# Altium project Mini-Rambo_0.3a.PrjPcb (part 1 of 2)
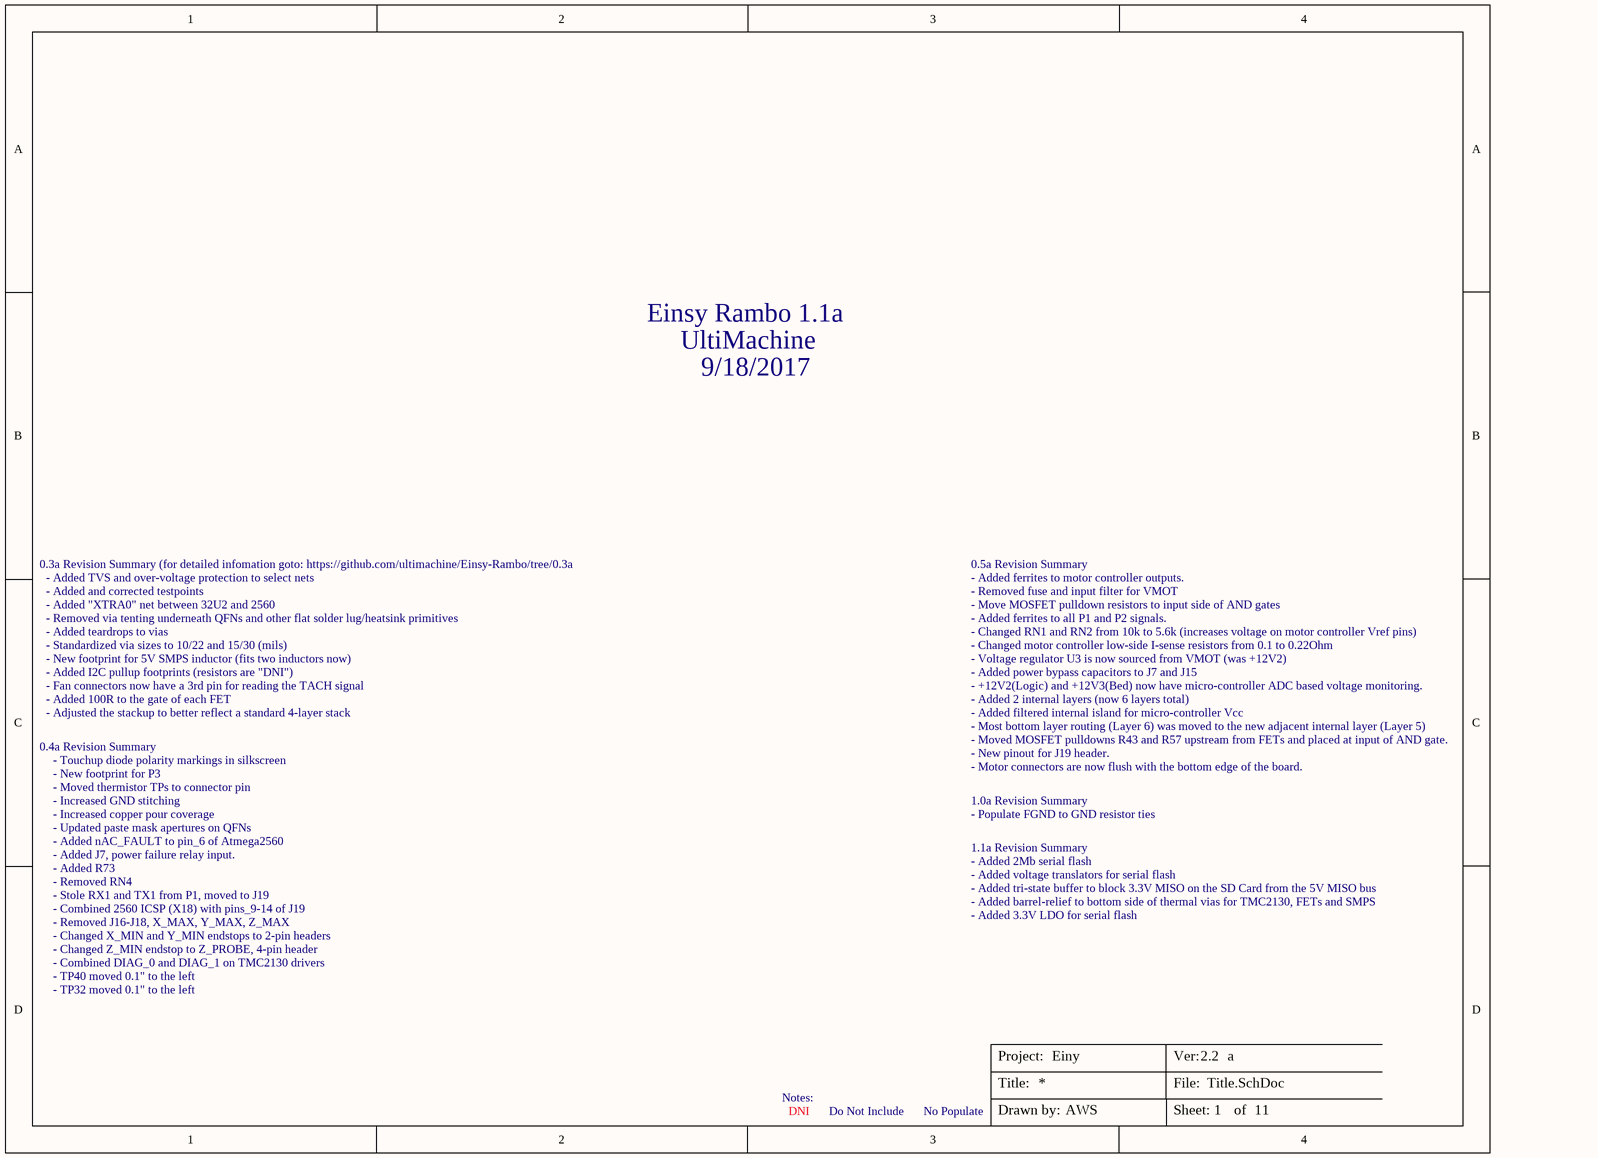
[diagram p0: Title.SchDoc]
projectBoardRevision: a; projectBoardVersion: 2.2; ProjectDesigner: AWS; ProjectTitle: Einy
11 sheets, 417 parts. Net scope: flat (ports and power ports of the same name join across sheets).
Board file: Mini-Rambo.PcbDoc
Sheets:
  Title.SchDoc
  Power-SMPS.SchDoc
  MCU.SchDoc
  USB-Serial.SchDoc
  Connectors.SchDoc
  Endstops.SchDoc
  Heaters.SchDoc
  Motor-X.SchDoc
  Motor-Y.SchDoc
  Motor-Z.SchDoc
  Motor-E.SchDoc

## Sheet Title.SchDoc
size Letter; SheetNumber: 1; SheetTotal: 11

### Notes on the sheet
- Einsy Rambo 1.1a
- UltiMachine
- 9/18/2017
- 0.3a Revision Summary (for detailed infomation goto: https://github.com/ultimachine/Einsy-Rambo/tree/0.3a
- 0.5a Revision Summary
- - Added TVS and over-voltage protection to select nets
- - Added and corrected testpoints
- - Added "XTRA0" net between 32U2 and 2560
- - Removed via tenting underneath QFNs and other flat solder lug/heatsink primitives
- - Added teardrops to vias
- - Added ferrites to motor controller outputs.
- - Removed fuse and input filter for VMOT
- - Move MOSFET pulldown resistors to input side of AND gates
- - Added ferrites to all P1 and P2 signals.
- - Changed RN1 and RN2 from 10k to 5.6k (increases voltage on motor controller Vref pins)
- - Standardized via sizes to 10/22 and 15/30 (mils)
- - New footprint for 5V SMPS inductor (fits two inductors now)
- - Added I2C pullup footprints (resistors are "DNI")
- - Fan connectors now have a 3rd pin for reading the TACH signal
- - Added 100R to the gate of each FET
- - Changed motor controller low-side I-sense resistors from 0.1 to 0.22Ohm
- - Voltage regulator U3 is now sourced from VMOT (was +12V2)
- - Added power bypass capacitors to J7 and J15
- - +12V2(Logic) and +12V3(Bed) now have micro-controller ADC based voltage monitoring.
- - Added 2 internal layers (now 6 layers total)
- 0.4a Revision Summary
- - Adjusted the stackup to better reflect a standard 4-layer stack
- - New footprint for P3
- - Touchup diode polarity markings in silkscreen
- - Added filtered internal island for micro-controller Vcc
- - Most bottom layer routing (Layer 6) was moved to the new adjacent internal layer (Layer 5)
- - Moved MOSFET pulldowns R43 and R57 upstream from FETs and placed at input of AND gate.
- - New pinout for J19 header.
- - Motor connectors are now flush with the bottom edge of the board.
- - Updated paste mask apertures on QFNs
- - Increased copper pour coverage
- - Increased GND stitching
- - Moved thermistor TPs to connector pin
- 1.0a Revision Summary
- - Populate FGND to GND resistor ties
- - Removed RN4
- - Added R73
- - Added nAC_FAULT to pin_6 of Atmega2560
- - Combined 2560 ICSP (X18) with pins_9-14 of J19
- - Stole RX1 and TX1 from P1, moved to J19
- - Added J7, power failure relay input.
- 1.1a Revision Summary
- - Added 2Mb serial flash
- - Added voltage translators for serial flash
- - Added tri-state buffer to block 3.3V MISO on the SD Card from the 5V MISO bus
- - Added barrel-relief to bottom side of thermal vias for TMC2130, FETs and SMPS
- - Removed J16-J18, X_MAX, Y_MAX, Z_MAX
- - Changed X_MIN and Y_MIN endstops to 2-pin headers
- - Changed Z_MIN endstop to Z_PROBE, 4-pin header
- - Combined DIAG_0 and DIAG_1 on TMC2130 drivers
- - Added 3.3V LDO for serial flash
- - TP40 moved 0.1" to the left
- - TP32 moved 0.1" to the left
- Notes:
- DNI
- Do Not Include
- No Populate
- Title:
- Project:
- File:
- Ver:
- Drawn by:
- Sheet:
- of

## Sheet Power-SMPS.SchDoc: Power-SMPS
size Letter; DocumentNumber: 5; SheetNumber: 2; SheetTotal: 11
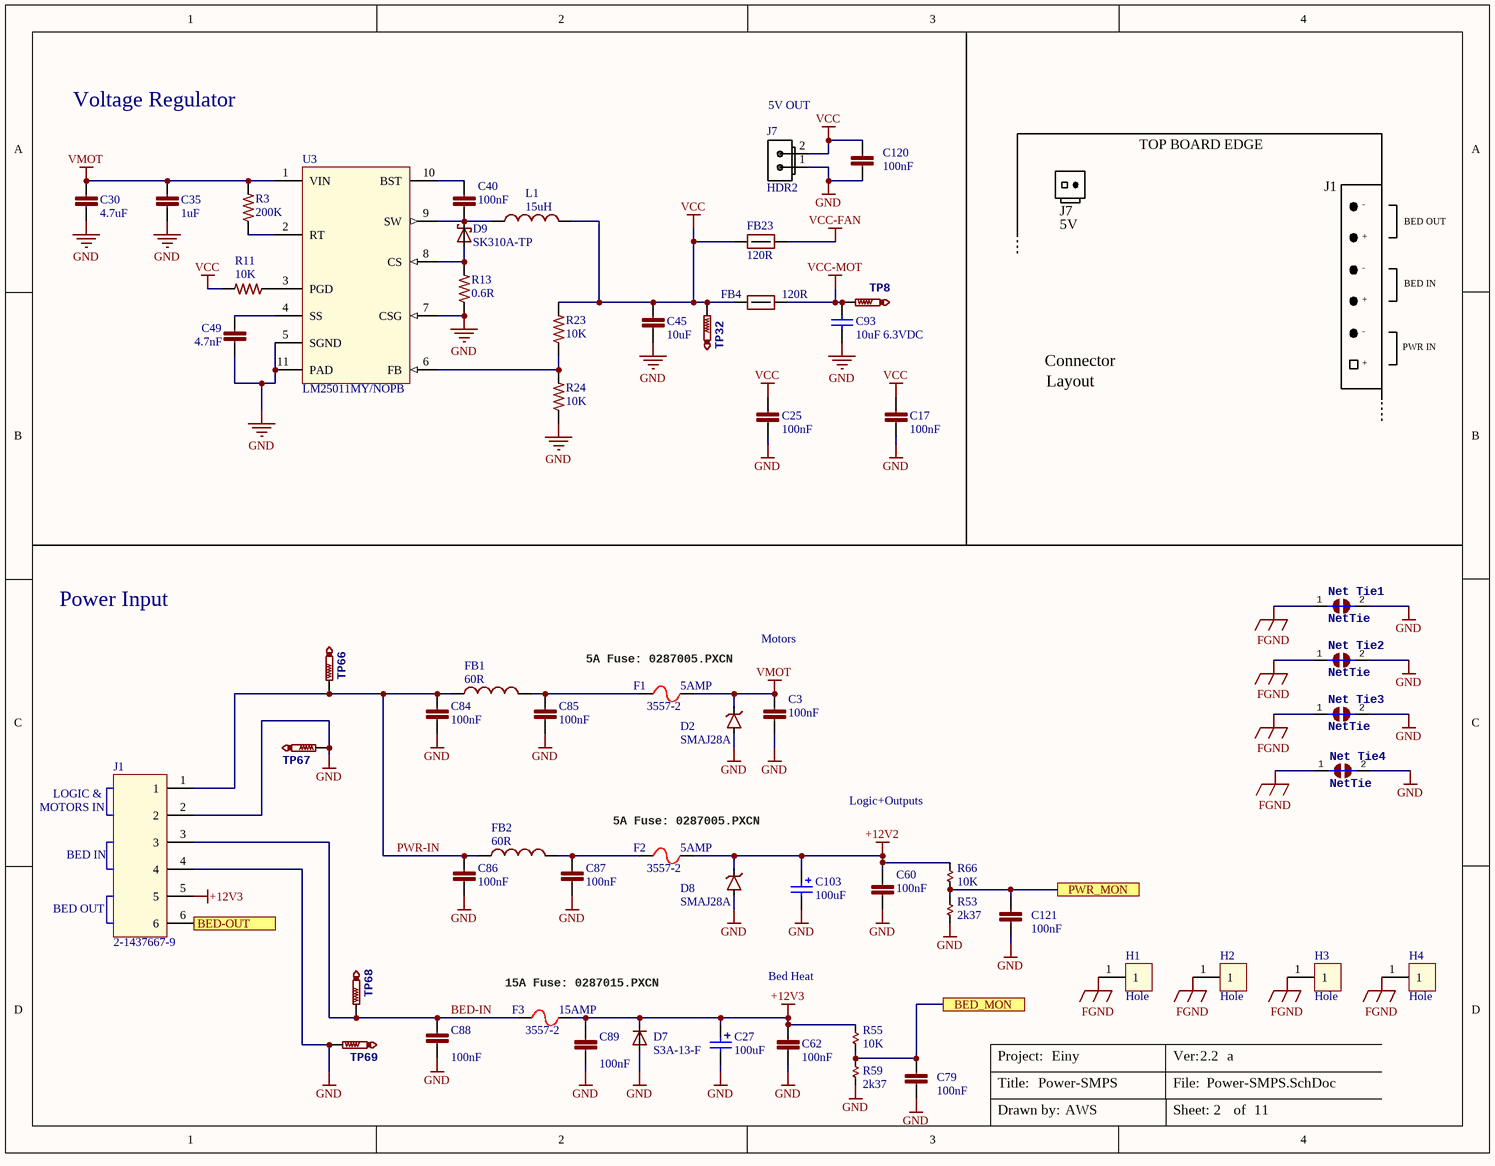
[diagram p1: Power-SMPS.SchDoc]

### Parts
C3  100nF  [C0603]
C17  100nF  [C0402]
C25  100nF  [C0603]
C27  value 100uF  [CAP-ELEC-063063077]  (hidden comment: UWT1V101MCL1GS)
C30  4.7uF  [C1206]
C35  1uF  [C0805]
C40  100nF  [C0603]
C45  10uF  [C0805]
C49  4.7nF  [C0402]
C60  100nF  [C0603]
C62  100nF  [C0603]
C79  100nF  [C0402]
C84  100nF  [C0603]
C85  100nF  [C0603]
C86  100nF  [C0603]
C87  100nF  [C0603]
C88  100nF  [C0603]
C89  100nF  [C0603]
C93  value 10uF 6.3VDC  [C0603]  (hidden comment: 0603)
C103  value 100uF  [CAP-ELEC-063063077]  (hidden comment: UWT1V101MCL1GS)
C120  100nF  [C0402]
C121  100nF  [C0402]
D2  SMAJ28A  [SMA-SM]
D7  S3A-13-F  [DO-214AB]
D8  SMAJ28A  [SMA-SM]
D9  SK310A-TP  [SMA-SM]
F1  3557-2  [3557]
F2  3557-2  [3557]
F3  3557-2  [3557]
FB1  value 60R  [L1806]  (hidden comment: BLM41PG600SN1L)
FB2  value 60R  [L1806]  (hidden comment: BLM41PG600SN1L)
FB4  120R  [FB0603]
FB23  120R  [FB0603]
H1  Hole  [Wave_hole_3x7-singleSided]  (no BOM)
H2  Hole  [Wave_hole_3x7-singleSided]  (no BOM)
H3  Hole  [Wave_hole_3x7-singleSided]  (no BOM)
H4  Hole  [Wave_hole_3x7-singleSided]  (no BOM)
J1  2-1437667-9  [CON-Barrier-6-8.26mm]
J7  value HDR2  [70543-02 PIN-IN-PASTE]  (hidden comment: CONN 2PIN VERT 0.1" SHRD LOCKING)
L1  15uH  [XAL50xx_VLS6045]
Net_Tie1  NetTie  [Net Tie]  (net tie, no BOM)
Net_Tie2  NetTie  [Net Tie]  (net tie, no BOM)
Net_Tie3  NetTie  [Net Tie]  (net tie, no BOM)
Net_Tie4  NetTie  [Net Tie]  (net tie, no BOM)
R3  200K  [R0402]
R11  10K  [R0402]
R13  0.6R  [2512R-0.55]
R23  10K  [R0402]
R24  10K  [R0402]
R53  2k37  [R0402]
R55  10K  [R0402]
R59  2k37  [R0402]
R66  10K  [R0402]
TP8  TestPoint  [TP1-27]  (value not drawn)  (no BOM)
TP32  TestPoint  [TP1-27]  (value not drawn)  (no BOM)
TP66  TestPoint  [TP1-27]  (value not drawn)  (no BOM)
TP67  TestPoint  [TP1-27]  (value not drawn)  (no BOM)
TP68  TestPoint  [TP1-27]  (value not drawn)  (no BOM)
TP69  TestPoint  [TP1-27]  (value not drawn)  (no BOM)
U3  LM25011MY/NOPB  [VSSOP10_ClosedBotVias]

### Ports
BED-OUT, BED_MON, PWR_MON

### Nets
+12V2: C60.1 C103.1 D8.K F2.2 R66.2
+12V3: C27.1 C62.1 C89.1 D7.C F3.2 J1.5 R55.2
FGND: H1.1 H2.1 H3.1 H4.1 Net_Tie1.1 Net_Tie2.1 Net_Tie3.1 Net_Tie4.1
GND: C3.2 C17.2 C25.2 C27.2 C30.2 C35.2 C45.2 C49.2 C60.2 C62.2 C79.2 C84.2 C85.2 C86.2 C87.2 C88.2 C89.2 C93.1 C103.2 C120.1 C121.2 D2.A D7.A D8.A J1.2 J1.4 J7.1(S) Net_Tie1.2 Net_Tie2.2 Net_Tie3.2 Net_Tie4.2 R13.1 R24.1 R53.2 R59.2 TP67.TP TP69.TP U3.5(SGND) U3.7(CSG) U3.11(PAD)
VCC: C17.1 C25.1 C45.1 C120.2 FB4.1 FB23.1 J7.2(S) L1.2 R11.2 R23.2 TP32.TP
VCC-FAN: FB23.2
VCC-MOT: C93.2 FB4.2 TP8.TP
VMOT: C3.1 C30.1 C35.1 D2.K F1.2 R3.2 U3.1(VIN)
BED-IN: C88.1 F3.1 J1.3 TP68.TP
BED-OUT: J1.6 ; port BED-OUT
BED_MON: C79.1 R55.1 R59.1 ; port BED_MON
PWR-IN: C84.1 C86.1 FB1.1 FB2.1 J1.1 TP66.TP
PWR_MON: C121.1 R53.1 R66.1 ; port PWR_MON
NetC40_1: C40.1 U3.10(BST)
NetC40_2: C40.2 D9.C L1.1 U3.9(SW)
NetC49_1: C49.1 U3.4(SS)
NetC85_1: C85.1 F1.1 FB1.2
NetC87_1: C87.1 F2.1 FB2.2
NetD9_A: D9.A R13.2 U3.8(CS)
NetR3_1: R3.1 U3.2(RT)
NetR11_1: R11.1 U3.3(PGD)
NetR23_1: R23.1 R24.2 U3.6(FB)

### Notes on the sheet
- Voltage Regulator
- (near J7) 5V OUT
- TOP BOARD EDGE
- J7
- 5V
- J1
- -
- BED OUT
- +
- BED IN
- Connector
- PWR IN
- Layout
- Power Input
- Motors
- (near F1) 5A Fuse: 0287005.PXCN
- (near F1) 5AMP
- MOTORS IN
- LOGIC &
- (near F2) 5A Fuse: 0287005.PXCN
- Logic+Outputs
- (near F2) 5AMP
- (near F3) 15A Fuse: 0287015.PXCN
- (near F3) 15AMP
- Bed Heat
- Title:
- Project:
- File:
- Ver:
- Drawn by:
- Sheet:
- of

### Library data of the parts
C3 C25 C40 C60 C62 C84-C89 = C0603C104K5RACTU: CAP CER 0603 100nF 50V 10% X7R; Manufacturer: Kemet; Part Description: 0.1µF ±10% 50V Ceramic Capacitor X7R 0603 (1608 Metric); EE_SPEC: 100nF 50V X7R 0603; Tolerance: +/- 10%; VALUE: 100nF; MANUFACTURER #: C0603C104K5RACTU; DISTRIBUTOR #: 399-5089-2-ND; DISTRIBUTOR: Digi-Key; PART: 100nF
C17 C79 C121 = GRM155R71C104KA88D: CAP CER 0402 100nF 16V 10% X7R; Manufacturer: Murata; Part Description: 0.10µF ±10% 16V Ceramic Capacitor X7R 0402 (1005 Metric); EE_SPEC: 100nF 16V X7R 0402; Tolerance: +/- 10%; VALUE: 100nF; MANUFACTURER #: GRM155R71C104KA88D; DISTRIBUTOR #: 490-3261-2-ND; DISTRIBUTOR: Digi-Key; PART: 100nF
C27 C103 = UWT1V101MCL1GS: CAP ALUM 100UF 35V 20% SMD; Manufacturer: Nichicon; Part Description: 100µF 35V Aluminum Capacitors Radial, Can - SMD 1000 Hrs @ 105°C; EE_SPEC: 100uF 35V Al-El; Tolerance: +/- 20%; MANUFACTURER #: UWT1V101MCL1GS; DISTRIBUTOR #: 493-2203-2-ND; DISTRIBUTOR: Digi-Key; PART: 100uF
C30 = C1206C475K5PACTU: CAP CER 1206 4.7uF 50V 10% X5R; Manufacturer: Kemet; Part Description: 4.7µF ±10% 50V Ceramic Capacitor X5R 1206 (3216 Metric); EE_SPEC: 4.7uF 50V X5R 1206; Tolerance: +/- 10%; VALUE: 4.7uF; MANUFACTURER #: C1206C475K5PACTU; DISTRIBUTOR #: 399-5507-2-ND; DISTRIBUTOR: Digi-Key; PART: 4.7uF
C35 = GRM21BR71H105KA12L: CAP CER 0805 1uF 50V 10% X7R; Manufacturer: Murata; Part Description: 1µF ±10% 50V Ceramic Capacitor X7R 0805 (2012 Metric); EE_SPEC: 1uF 50V X7R 0805; Tolerance: +/- 10%; VALUE: 1uF; MANUFACTURER #: GRM21BR71H105KA12L; DISTRIBUTOR #: 490-4736-2-ND; DISTRIBUTOR: Digi-Key; PART: 1uF
C45 = C0805C106K8PACTU: CAP CER 0805 10uF 10V 10% X5R; Manufacturer: Kemet; Part Description: 10µF ±10% 10V Ceramic Capacitor X5R 0805 (2012 Metric); EE_SPEC: 10uF 10V X5R 0805; Tolerance: +/- 10%; VALUE: 10uF; MANUFACTURER #: C0805C106K8PACTU; DISTRIBUTOR #: 399-4925-2-ND; DISTRIBUTOR: Digi-Key; PART: 10uF
C49 = CC0402KRX7R8BB472: CAP CER 0402 4.7nF 25V 10% X7R; Manufacturer: YAGEO; Part Description: 4700pF ±10% 25V Ceramic Capacitor X7R 0402 (1005 Metric); EE_SPEC: 4.7nF 25V X7R 0402; Tolerance: +/- 10%; VALUE: 4.7nF; MANUFACTURER #: CC0402KRX7R8BB472; DISTRIBUTOR #: 311-1039-2-ND; DISTRIBUTOR: Digi-Key; PART: 4.7nF
C93 = C1608JB0J106K080AB: CAP CER 10UF 6.3V 10% JB 0603; Manufacturer: TDK; Tolerance: +/- 10%; EE_SPEC: 6.3VDC; Part Description: CAP CER 10UF 6.3V 10% JB 0603; MANUFACTURER #: C1608JB0J106K080AB; DISTRIBUTOR #: 445-11185-1-ND; DISTRIBUTOR: Digi-Key; PART: 10uF 6.3VDC
C120 = GRM155R71C104KA88D: CAP CER 0402 100nF 16V 10% X7R; MANUFACTURER: Murata; PART DESCRIPTION: 0.10µF ±10% 16V Ceramic Capacitor X7R 0402 (1005 Metric); TOLERANCE: +/- 10%; EE_SPEC: 100nF 16V X7R 0402; VALUE: 100nF; MANUFACTURER #: GRM155R71C104KA88D; DISTRIBUTOR #: 490-3261-2-ND; DISTRIBUTOR: Digi-Key; PART: 100nF
D2 D8 = SMAJ28A: TVS DIODE 28VWM 45.4VC SMA; Manufacturer: Diodes Inc; MANUFACTURER #: SMAJ28A-13-F; EE_SPEC: 28Vrs 45.4Vc; Tolerance: NA; DISTRIBUTOR #: SMAJ28A-FDITR-ND; DISTRIBUTOR: Digi-Key; PART: SMAJ28A; Part Description: TVS DIODE 28VWM 45.4VC SMA; VALUE: SMAJ28A
D7 = S3A-13-F: DIODE DO-214AB; Manufacturer: Diodes Incorporated; Part Description: Diode Standard 50V 3A Surface Mount SMC; EE_SPEC: 50V 3A 1.15Vf; Tolerance: NA; Value: S3A-13-F; DISTRIBUTOR #: S3A-FDITR-ND; DISTRIBUTOR: Digi-Key; MANUFACTURER #: S3A-13-F; PART: S3A-13-F
D9 = SK310A: DIODE Schottky 3A SMA; Manufacturer: MCC; MANUFACTURER #: SK310A-LTP; Part Description: Diode Schottky 100V 3A Surface Mount DO-214AC (SMA); EE_SPEC: 3A 100V; Tolerance: NA; VALUE: SK310A; DISTRIBUTOR #: SK310A-LTPMSTR-ND; DISTRIBUTOR: Digi-Key; PART: SK310A
F1-F3 = 3557-2: FUSE PTH ATO; Manufacturer: Keystone; Part Description: FUSE BLOCK BLADE 500V 30A PCB; EE_SPEC: ATC 500V 30A; Tolerance: NA; MANUFACTURER #: 3557-2; DISTRIBUTOR #: 36-3557-2-ND; DISTRIBUTOR: Digi-Key; PART: Fuse; VALUE: Fuse
FB1 FB2 = BLM41PG600SN1L: FERRITE BEAD 1806 60ohm; Manufacturer: Murata; PART: 60Rf; Part Description: FERRITE BEAD 60 OHM 1806 1LN; EE_SPEC: 60R 6A 0.009Ohm; Tolerance: NA; MANUFACTURER #: BLM41PG600SN1L; DISTRIBUTOR #: 490-1058-2-ND; DISTRIBUTOR: Digi-Key
FB4 FB23 = FERRITE 120R 3A 0603: FERRITE BEAD 120 OHM 0603 1LN; MANUFACTURER: Samsung; MANUFACTURER #: CIS10P121AC; VALUE: 120Rfb; TOLERANCE: -NA-; EE_SPEC: 3A; DISTRIBUTOR #: 1276-6351-2-ND; PART: FERRITE 120R 3A 0603; PART DESCRIPTION: FERRITE BEAD 120 OHM 0603 1LN
  FB4: DISTRIBUTOR: DigiKey
  FB23: DISTRIBUTOR: Digikey
J1 = 2-1437667-9: CONN BARRIER STRIP 6CIRC 0.325"; MANUFACTURER #: 4DB-P108-06; Manufacturer: TE; PART: 6POS; Part Description: 6 Circuit 0.325" (8.26mm) Barrier Block Connector, Screws with Captive Plate; EE_SPEC: 150V 2A; Tolerance: NA; VALUE: 6POS; DISTRIBUTOR #: A98476-ND; DISTRIBUTOR: Digi-Key
J7 = CONN 2PIN VERT 0.1" SHRD LOCKING PIN-IN-PASTE: Connector 2pos; MANUFACTURER: Molex; MANUFACTURER #: 0705430001; PART: 2 Pin Conn; PART DESCRIPTION: 2 Positions Header, Shrouded Connector 0.100" (2.54mm) Through Hole Gold; TOLERANCE: -NA-; DISTRIBUTOR #: WM4800-ND; DISTRIBUTOR: Digikey; EE_SPEC: -NA-
L1 = IND 15uH 2.5A 0.075R: FIXED IND 15UH 2.5A 98 MOHM SMD; Manufacturer: TDK; MANUFACTURER #: VLS6045EX-150M; Part Description: 15µH Shielded Wirewound Inductor 2.5A 98 mOhm Max Nonstandard; EE_SPEC: 15uH 2.5A 0.098-Ohm; Tolerance: +/- 20%; ManufacturerPartNumber2: XAL5050-153MEB; Value: 15uH; Manufacturer2: Coilcraft; DISTRIBUTOR #: 445-173041-2-ND; DISTRIBUTOR: Digi-Key; PART: 15uH
Net_Tie1-Net_Tie4 = NetTie: Net Tie; LastRevisionNote: ImportComponents; Published: 23-Apr-2014; Publisher: UltiMachine; LastRevisionDate: 23-Apr-2014
R3 = CRCW0402200KFKED: RES 0402 200K; Manufacturer: Vishay Dale; Part Description: 200k Ohm ±1% 0.063W, 1/16W Chip Resistor 0402 (1005 Metric) Automotive AEC-Q200 Thick Film; EE_SPEC: 200k 1% 0402; Tolerance: +/- 1%; VALUE: 200K; MANUFACTURER #: CRCW0402200KFKED; DISTRIBUTOR #: 541-200KLTR-ND; DISTRIBUTOR: Digi-Key; PART: 200K
R11 R23 R24 = RC0402FR-0710KP: RES SMD 10K OHM 1% 1/16W 0402; MANUFACTURER: Yageo; PART: 10k 1% 0402; PART DESCRIPTION: 10k Ohm ±1% 0.063W, 1/16W Chip Resistor 0402 (1005 Metric) Moisture Resistant Thick Film; EE_SPEC: 10k 1% 0402 1/16W; VALUE: 10K; MANUFACTURER #: RC0402FR-0710KP; DISTRIBUTOR #: YAG1249TR-ND; DISTRIBUTOR: Digi-Key; TOLERANCE: 1%
R13 = RL2512FK-070R06L: RES 0.06 OHM 1W 1% 2512 SMD; Manufacturer: Yageo; Part Description: 0.06 Ohm ±1% 1W Chip Resistor 2512 (6432 Metric) Automotive AEC-Q200, Current Sense, Moisture Resistant Thick Film; EE_SPEC: 0.06R 1% 2512; VALUE: 0.6R; MANUFACTURER #: RL2512FK-070R06L; DISTRIBUTOR #: 311-0.06TTR-ND; DISTRIBUTOR: Digi-Key; PART: 0.6R; Tolerance: 1%
R53 R59 = RC0402FR-072K37L: RES SMD 2.37K OHM 1% 1/16W 0402; Manufacturer: Yageo; Part Description: 2.37k Ohm ±1% 0.063W, 1/16W Chip Resistor 0402 (1005 Metric) Moisture Resistant Thick Film; EE_SPEC: 2.37k 1% 0402; Tolerance: +/- 1%; VALUE: 2k37; MANUFACTURER #: RC0402FR-072K37L; DISTRIBUTOR #: 311-2.37KLRTR-ND; DISTRIBUTOR: Digi-Key; PART: 2.37k
R55 R66 = 10k 1% 0402: RES SMD 10K OHM 1% 1/16W 0402; MANUFACTURER: Yageo; MANUFACTURER #: RC0402FR-0710KP; PART DESCRIPTION: 10k Ohm ±1% 0.063W, 1/16W Chip Resistor 0402 (1005 Metric) Moisture Resistant Thick Film; EE_SPEC: 10k 1% 0402 1/16W; DISTRIBUTOR #: YAG1249TR-ND; DISTRIBUTOR: Digi-key; PART: 10k 1% 0402; TOLERANCE: 1%; VALUE: 10K
TP8 TP32 TP66-TP69 = TestPoint: Test Point
U3 = LM25011_ClosedBotVias: REG BUCK; MANUFACTURER: Texas Instruments; PART: IC VREG BUCK ADJ 2A 10MSOP; PART DESCRIPTION: Buck Switching Regulator IC Positive Adjustable 2.51V 1 Output 2A 10-TFSOP, 10-MSOP (0.118", 3.00mm Width) Exposed Pad; TOLERANCE: -NA-; EE_SPEC: 2A 42Vin_max; VALUE: LM25011MY/NOPB; MANUFACTURER #: LM25011MY/NOPB; DISTRIBUTOR #: LM25011MY/NOPBTR-ND; DISTRIBUTOR: Digikey

## Sheet MCU.SchDoc: MCU
size Letter; DocumentNumber: 2; SheetNumber: 3; SheetTotal: 11
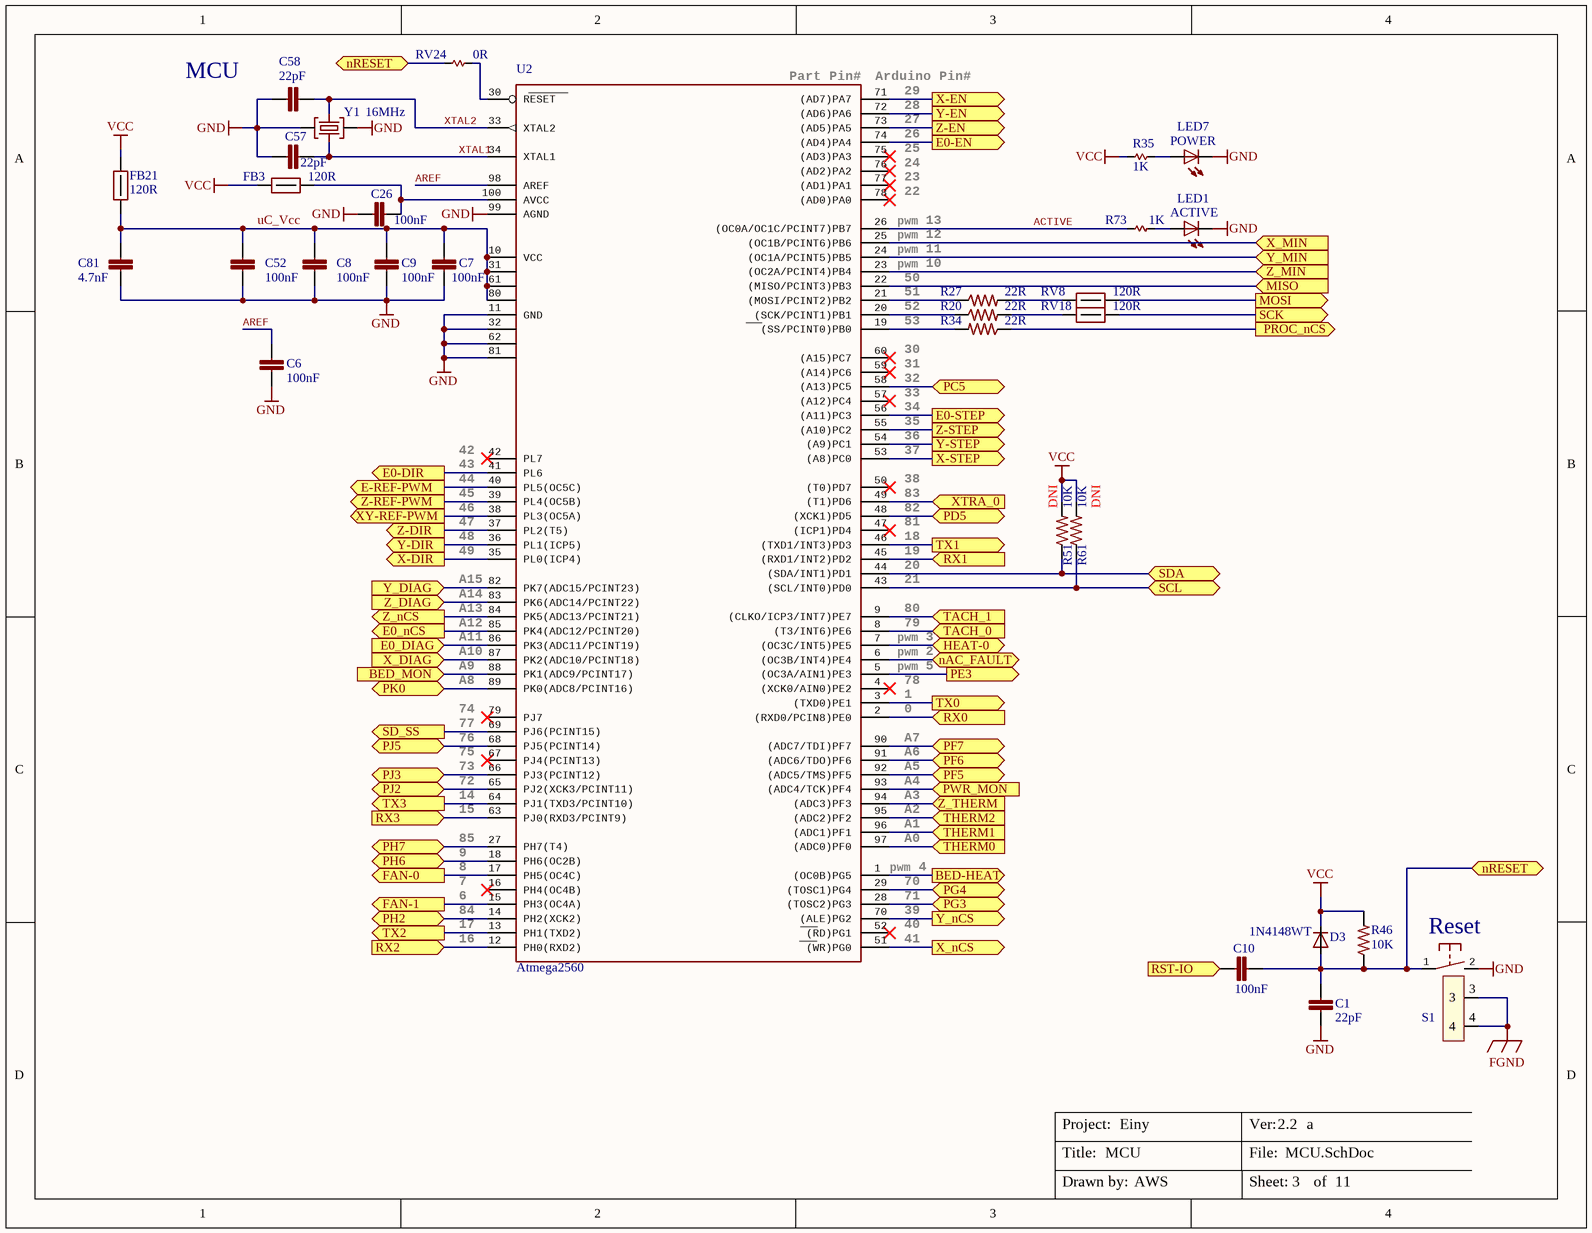
[diagram p2: MCU.SchDoc]

### Parts
C1  22pF  [C0402]
C6  100nF  [C0402]
C7  100nF  [C0402]
C8  100nF  [C0402]
C9  100nF  [C0402]
C10  100nF  [C0402]
C26  100nF  [C0402]
C52  100nF  [C0402]
C57  22pF  [C0402]
C58  22pF  [C0402]
C81  4.7nF  [C0402]
D3  1N4148WT  [SOD523]
FB3  120R  [FB0603]
FB21  120R  [FB0603]
LED1  YEL  [LED2012120]  (value not drawn)
LED7  GRN  [LED2012120]  (value not drawn)
R20  22R  [R0402]
R27  22R  [R0402]
R34  22R  [R0402]
R35  1K  [R0402]
R46  10K  [R0402]
R51  10K  [R0402]
R61  10K  [R0402]
R73  1K  [R0402]
RV8  120R  [R0402]
RV18  120R  [R0402]
RV24  0R  [R0402]
S1  1571610-2  [B3F-31XX]  (value not drawn)
U2  Atmega2560  [TSQFP50P1600X1600X120-100L]
Y1  value 16MHz  [CRYS320250]  (hidden comment: 7M-16.000MEEQ-T)

### Ports
BED-HEAT, BED_MON, E0-DIR, E0-EN, E0-STEP, E0_DIAG, E0_nCS, E-REF-PWM, FAN-0, FAN-1, HEAT-0, MISO, MOSI, nAC_FAULT, nRESET, PC5, PD5, PE3, PF5, PF6, PF7, PG3, PG4, PH2, PH6, PH7, PJ2, PJ3, PJ5, PK0, PROC_nCS, PWR_MON, RST-IO, RX0, RX1, RX2, RX3, SCK, SCL, SD_SS, SDA, TACH_0, TACH_1, THERM0, THERM1, THERM2, TX0, TX1, TX2, TX3, X-DIR, X-EN, X-STEP, X_DIAG, X_MIN, X_nCS, XTRA_0, XY-REF-PWM, Y-DIR, Y-EN, Y-STEP, Y_DIAG, Y_MIN, Y_nCS, Z-DIR, Z-EN, Z-REF-PWM, Z-STEP, Z_DIAG, Z_MIN, Z_nCS, Z_THERM

### Nets
FGND: S1.3 S1.4
GND: C1.2 C6.2 C7.2 C8.2 C9.2 C26.2 C52.2 C57.2 C58.2 C81.2 LED1.C LED7.C S1.2(S) U2.11(GND) U2.32(GND1) U2.62(GND2) U2.81(GND3) U2.99(AGND) Y1.2(GND) Y1.4(GND)
VCC: D3.C FB3.1 FB21.1 R35.2 R46.2 R51.2 R61.2
ACTIVE: R73.2 U2.26((OC0A/OC1C/PCINT7)PB7)
AREF: C6.1 U2.98(AREF)
BED-HEAT: U2.1((OC0B)PG5) ; port BED-HEAT
BED_MON: U2.88(PK1(ADC9/PCINT17)) ; port BED_MON
E0-DIR: U2.41(PL6) ; port E0-DIR
E0-EN: U2.74((AD4)PA4) ; port E0-EN
E0-STEP: U2.56((A11)PC3) ; port E0-STEP
E0_DIAG: U2.86(PK3(ADC11/PCINT19)) ; port E0_DIAG
E0_nCS: U2.85(PK4(ADC12/PCINT20)) ; port E0_nCS
E-REF-PWM: U2.40(PL5(OC5C)) ; port E-REF-PWM
FAN-0: U2.17(PH5(OC4C)) ; port FAN-0
FAN-1: U2.15(PH3(OC4A)) ; port FAN-1
HEAT-0: U2.7((OC3C/INT5)PE5) ; port HEAT-0
MISO: U2.22((MISO/PCINT3)PB3) ; port MISO
MOSI: RV8.2 ; port MOSI
nAC_FAULT: U2.6((OC3B/INT4)PE4) ; port nAC_FAULT
nRESET: C1.1 C10.2 D3.A R46.1 RV24.1 S1.1(P) ; port nRESET
PC5: U2.58((A13)PC5) ; port PC5
PD5: U2.48((XCK1)PD5) ; port PD5
PE3: U2.5((OC3A/AIN1)PE3) ; port PE3
PF5: U2.92((ADC5/TMS)PF5) ; port PF5
PF6: U2.91((ADC6/TDO)PF6) ; port PF6
PF7: U2.90((ADC7/TDI)PF7) ; port PF7
PG3: U2.28((TOSC2)PG3) ; port PG3
PG4: U2.29((TOSC1)PG4) ; port PG4
PH2: U2.14(PH2(XCK2)) ; port PH2
PH6: U2.18(PH6(OC2B)) ; port PH6
PH7: U2.27(PH7(T4)) ; port PH7
PJ2: U2.65(PJ2(XCK3/PCINT11)) ; port PJ2
PJ3: U2.66(PJ3(PCINT12)) ; port PJ3
PJ5: U2.68(PJ5(PCINT14)) ; port PJ5
PK0: U2.89(PK0(ADC8/PCINT16)) ; port PK0
PROC_nCS: R34.1 ; port PROC_nCS
PWR_MON: U2.93((ADC4/TCK)PF4) ; port PWR_MON
RST-IO: C10.1 ; port RST-IO
RX0: U2.2((RXD0/PCIN8)PE0) ; port RX0
RX1: U2.45((RXD1/INT2)PD2) ; port RX1
RX2: U2.12(PH0(RXD2)) ; port RX2
RX3: U2.63(PJ0(RXD3/PCINT9)) ; port RX3
SCK: RV18.2 ; port SCK
SCL: R61.1 U2.43((SCL/INT0)PD0) ; port SCL
SD_SS: U2.69(PJ6(PCINT15)) ; port SD_SS
SDA: R51.1 U2.44((SDA/INT1)PD1) ; port SDA
TACH_0: U2.8((T3/INT6)PE6) ; port TACH_0
TACH_1: U2.9((CLKO/ICP3/INT7)PE7) ; port TACH_1
THERM0: U2.97((ADC0)PF0) ; port THERM0
THERM1: U2.96((ADC1)PF1) ; port THERM1
THERM2: U2.95((ADC2)PF2) ; port THERM2
TX0: U2.3((TXD0)PE1) ; port TX0
TX1: U2.46((TXD1/INT3)PD3) ; port TX1
TX2: U2.13(PH1(TXD2)) ; port TX2
TX3: U2.64(PJ1(TXD3/PCINT10)) ; port TX3
uC_Vcc: C7.1 C8.1 C9.1 C52.1 C81.1 FB21.2 U2.10(VCC) U2.31(VCC1) U2.61(VCC2) U2.80(VCC3)
X-DIR: U2.35(PL0(ICP4)) ; port X-DIR
X-EN: U2.71((AD7)PA7) ; port X-EN
X-STEP: U2.53((A8)PC0) ; port X-STEP
X_DIAG: U2.87(PK2(ADC10/PCINT18)) ; port X_DIAG
X_MIN: U2.25((OC1B/PCINT6)PB6) ; port X_MIN
X_nCS: U2.51((WR)PG0) ; port X_nCS
XTAL1: C57.1 U2.34(XTAL1) Y1.1(C1)
XTAL2: C58.1 U2.33(XTAL2) Y1.3(C2)
XTRA_0: U2.49((T1)PD6) ; port XTRA_0
XY-REF-PWM: U2.38(PL3(OC5A)) ; port XY-REF-PWM
Y-DIR: U2.36(PL1(ICP5)) ; port Y-DIR
Y-EN: U2.72((AD6)PA6) ; port Y-EN
Y-STEP: U2.54((A9)PC1) ; port Y-STEP
Y_DIAG: U2.82(PK7(ADC15/PCINT23)) ; port Y_DIAG
Y_MIN: U2.24((OC1A/PCINT5)PB5) ; port Y_MIN
Y_nCS: U2.70((ALE)PG2) ; port Y_nCS
Z-DIR: U2.37(PL2(T5)) ; port Z-DIR
Z-EN: U2.73((AD5)PA5) ; port Z-EN
Z-REF-PWM: U2.39(PL4(OC5B)) ; port Z-REF-PWM
Z-STEP: U2.55((A10)PC2) ; port Z-STEP
Z_DIAG: U2.83(PK6(ADC14/PCINT22)) ; port Z_DIAG
Z_MIN: U2.23((OC2A/PCINT4)PB4) ; port Z_MIN
Z_nCS: U2.84(PK5(ADC13/PCINT21)) ; port Z_nCS
Z_THERM: U2.94((ADC3)PF3) ; port Z_THERM
NetC26_1: C26.1 FB3.2 U2.100(AVCC)
NetLED1_A: LED1.A R73.1
NetLED7_A: LED7.A R35.1
NetR20_1: R20.1 U2.20((SCK/PCINT1)PB1)
NetR20_2: R20.2 RV18.1
NetR27_1: R27.1 U2.21((MOSI/PCINT2)PB2)
NetR27_2: R27.2 RV8.1
NetR34_2: R34.2 U2.19((SS/PCINT0)PB0)
NetRV24_2: RV24.2 U2.30(RESET)

Not connected (* = marked no-connect by the designer): U2 4((XCK0/AIN0)PE2)* 16(PH4(OC4B))* 42(PL7)* 47((ICP1)PD4)* 50((T0)PD7)* 52((RD)PG1)* 57((A12)PC4)* 59((A14)PC6)* 60((A15)PC7)* 67(PJ4(PCINT13))* 75((AD3)PA3)* 76((AD2)PA2)* 77((AD1)PA1)* 78((AD0)PA0)* 79(PJ7)*

### Notes on the sheet
- MCU
- (near U2) Part Pin#
- (near U2) Arduino Pin#
- (near U2) 28
- (near U2) 29
- (near U2) 24
- (near U2) 25
- (near U2) 26
- (near U2) 27
- (near LED7) POWER
- (near U2) pwm
- (near U2) 22
- (near U2) 23
- 11
- 12
- 13
- (near LED1) ACTIVE
- 50
- 51
- 52
- 10
- 30
- 31
- 32
- (near U2) 33
- 53
- (near U2) 42
- (near U2) 34
- (near U2) 35
- (near U2) 36
- (near U2) 37
- (near U2) 43
- (near U2) 44
- (near U2) 45
- (near U2) 46
- (near U2) 47
- (near U2) 48
- (near U2) 18
- (near U2) 38
- (near U2) 81
- (near U2) 82
- (near U2) 83
- (near U2) 49
- (near U2) A14
- (near U2) A15
- (near U2) 19
- (near U2) 20
- (near U2) 21
- (near U2) A8
- (near U2) A9
- (near U2) A10
- (near U2) A11
- (near U2) A12
- (near U2) A13
- (near U2) 78
- (near U2) 79
- (near U2) 80
- 2
- 3
- 5
- (near U2) 74
- (near U2) 76
- (near U2) 77
- (near U2) A7
- (near U2) 0
- (near U2) 1
- (near U2) 15
- (near U2) 14
- (near U2) 72
- (near U2) 73
- (near U2) 75
- (near U2) A6
- (near U2) A5
- (near U2) A4
- (near U2) A3
- (near U2) A2
- (near U2) A1
- (near U2) 7
- (near U2) 8
- (near U2) 9
- (near U2) 85
- (near U2) A0
- (near U2) 70
- 4
- (near U2) 6
- (near U2) 84
- (near U2) 16
- (near U2) 17
- (near U2) 39
- (near U2) 40
- (near U2) 41
- (near U2) 71
- (near S1) Reset
- Title:
- Project:
- File:
- Ver:
- Drawn by:
- Sheet:
- of

### Library data of the parts
C1 C57 C58 = 04025A220JAT2A: CAP CER 0402 22pF 50V 5% C0G; Manufacturer: AVX; Part Description: 22pF ±5% 50V Ceramic Capacitor C0G, NP0 0402 (1005 Metric); EE_SPEC: 22pF 5% 50V NP0 0402; VALUE: 22pF; MANUFACTURER #: 04025A220JAT2A; DISTRIBUTOR #: 478-1074-2-ND; DISTRIBUTOR: Digi-Key; PART: 22pF 50V; Tolerance: 5%
C6-C10 C26 C52 = GRM155R71C104KA88D: as C17 on sheet Power-SMPS; VALUE: 100nF; MANUFACTURER #: GRM155R71C104KA88D; DISTRIBUTOR #: 490-3261-2-ND; DISTRIBUTOR: Digi-Key; PART: 100nF
C81 = CC0402KRX7R8BB472: as C49 on sheet Power-SMPS; VALUE: 4.7nF; MANUFACTURER #: CC0402KRX7R8BB472; DISTRIBUTOR #: 311-1039-2-ND; DISTRIBUTOR: Digi-Key; PART: 4.7nF
D3 = 1N4148WT: DIODE SOD523; Manufacturer: Fairchild; Part Description: DIODE GEN PURP 75V 200MA SOD523F; EE_SPEC: 75V 0.2A; Tolerance: NA; Value: 1N4148WT; DISTRIBUTOR #: 1N4148WTTR-ND; DISTRIBUTOR: Digi-Key; MANUFACTURER #: 1N4148WT; PART: 1N4148WT
FB3 FB21 = FERRITE 120R 3A 0603: as FB4 on sheet Power-SMPS; DISTRIBUTOR #: 1276-6351-2-ND; PART: FERRITE 120R 3A 0603; PART DESCRIPTION: FERRITE BEAD 120 OHM 0603 1LN
  FB3: DISTRIBUTOR: DigiKey
  FB21: DISTRIBUTOR: Digikey
LED1 = 5988140107F: LED 0805 Yellow; Manufacturer: Dialight; Part Description: Yellow 593nm LED Indication - Discrete 2V 0805 (2012 Metric); EE_SPEC: 2V 0.02A; Tolerance: NA; VALUE: YEL; DISTRIBUTOR #: 350-2041-2-ND; DISTRIBUTOR: Digi-Key; MANUFACTURER #: 5988140107F; PART: YEL
LED7 = 5988170107F: LED 0805 Green; Manufacturer: Dialight; Part Description: Green 566nm LED Indication - Discrete 2V 0805 (2012 Metric); EE_SPEC: 2V 0.02A; Tolerance: NA; VALUE: GRN; DISTRIBUTOR #: 350-2044-2-ND; DISTRIBUTOR: Digi-Key; MANUFACTURER #: 5988170107F; PART: GRN
R20 R27 R34 = RC0402FR-0722RL: RES 0402 22r 62.5mW 1%; Manufacturer: Yageo; Part Description: 22 Ohm ±1% 0.063W, 1/16W Chip Resistor 0402 (1005 Metric) Moisture Resistant Thick Film; EE_SPEC: 22R 1% 0402; Tolerance: +/- 1%; VALUE: 22R; DISTRIBUTOR #: 311-22.0LRTR-ND; DISTRIBUTOR: Digi-Key; MANUFACTURER #: RC0402FR-0722RL; PART: 22R
R35 R73 = RC0402FR-071KL: RES SMD 1K OHM 1% 1/16W 0402; Manufacturer: Yageo; Part Description: 1k Ohm ±1% 0.063W, 1/16W Chip Resistor 0402 (1005 Metric) Moisture Resistant Thick Film; EE_SPEC: 1k 1% 0402; Tolerance: +/- 1%; VALUE: 1K; MANUFACTURER #: RC0402FR-071KL; DISTRIBUTOR #: 311-1.00KLRTR-ND; DISTRIBUTOR: Digi-Key; PART: 1k
R46 R51 R61 = RC0402FR-0710KP: as R11 on sheet Power-SMPS; VALUE: 10K; MANUFACTURER #: RC0402FR-0710KP; DISTRIBUTOR #: YAG1249TR-ND; DISTRIBUTOR: Digi-Key; TOLERANCE: 1%
  R51 R61: DNI: DNI
RV8 RV18 = FERRITE 120R 1A 0402: FERRITE BEAD 120 OHM 0402 1LN; MANUFACTURER: Taiyo Yuden; MANUFACTURER #: BKP1005HS121-T; VALUE: 120Rfb; TOLERANCE: -NA-; EE_SPEC: 1A; DISTRIBUTOR #: 587-1921-2-ND; DISTRIBUTOR: Digikey; PART: FERRITE 120R 1A 0402; PART DESCRIPTION: FERRITE BEAD 120 OHM 0402 1LN
RV24 = 0R 0402: RES SMD 0.0OHM JUMPER 1/10W 0402; MANUFACTURER: Panasonic; MANUFACTURER #: ERJ-2GE0R00X; PART DESCRIPTION: 0.0 Ohm Jumper 0.1W, 1/10W Chip Resistor 0402 (1005 Metric) Automotive AEC-Q200 Thick Film; MANUFACTURER2#: RC0402JR-070RL; TOLERANCE: 1%; DISTRIBUTOR #: P0.0JTR-ND; DISTRIBUTOR: Digikey; PART: 0R; VALUE: 0R
S1 = 1571610-2: SWTCH Momentary Washable; Manufacturer: TE; PART: Tact PB R/A; Part Description: Tactile Switches R/A SEALED TACT SWITCH; EE_SPEC: 24V 0.05A; Tolerance: NA; VALUE: Tact PB R/A; DISTRIBUTOR #: 506-1571610-2; DISTRIBUTOR: Digi-Key; MANUFACTURER #: 1571610-2
U2 = ATMEGA2560AU_SM: Manufacturer: Microchip; MANUFACTURER #: ATMEGA2560-16AUR; Part Description: AVR AVR® ATmega Microcontroller IC 8-Bit 16MHz 256KB (128K x 16) FLASH 100-TQFP (14x14); EE_SPEC: 5V 256KB 8KB 16MHz; Tolerance: NA; DISTRIBUTOR #: ATMEGA2560-16AURTR-ND; DISTRIBUTOR: Digi-Key; PART: ATMEGA2560; VALUE: ATMEGA2560
Y1 = 7M-16.000MEEQ-T: Crystal 16mHz 10ppm 10pF; Manufacturer: TXC; Part Description: CRYSTAL 16.0000MHZ 10PF SMD; EE_SPEC: 10ppm 10pF 80R; MANUFACTURER #: 7M-16.000MEEQ-T; DISTRIBUTOR #: 887-1319-2-ND; DISTRIBUTOR: Digi-Key; PART: 16MHz; Tolerance: 10ppm

## Sheet USB-Serial.SchDoc: USB-Serial
size Letter; SheetNumber: 4; SheetTotal: 11
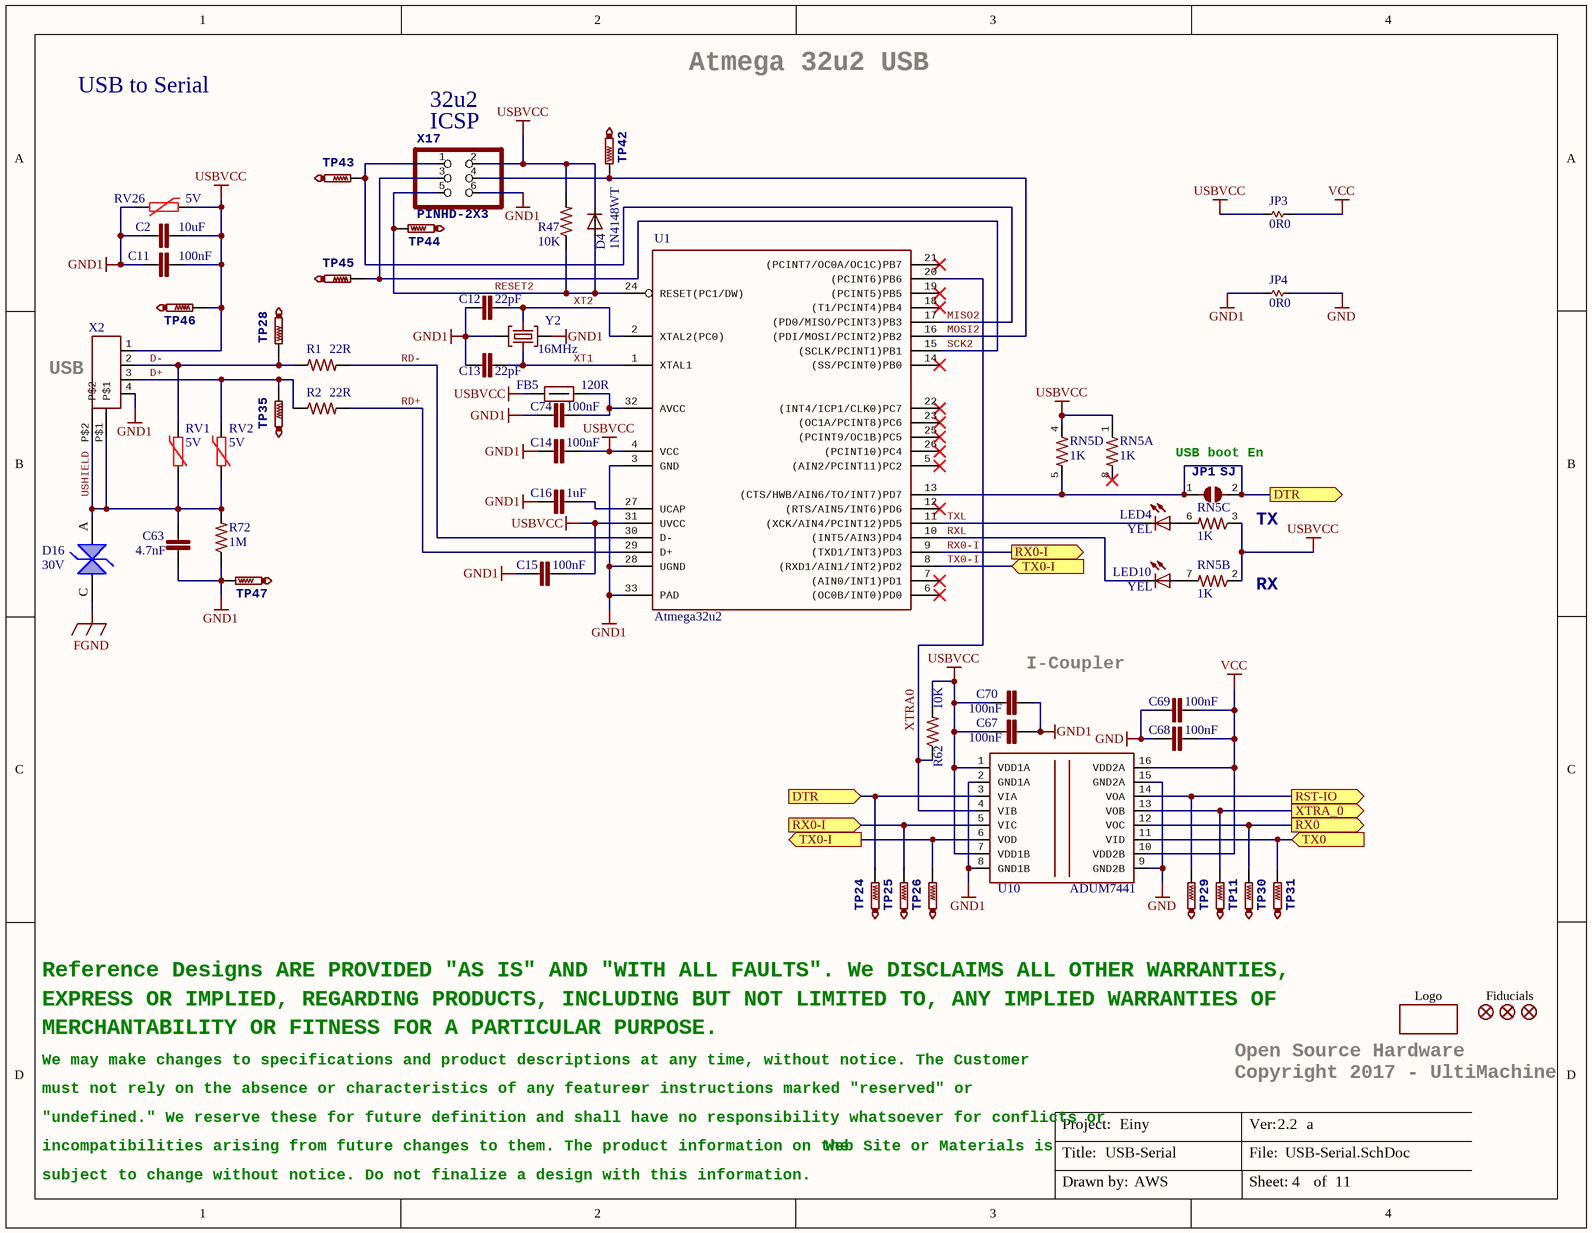
[diagram p3: USB-Serial.SchDoc]

### Parts
C2  10uF  [C0805]
C11  100nF  [C0402]
C12  22pF  [C0402]
C13  22pF  [C0402]
C14  100nF  [C0402]
C15  100nF  [C0402]
C16  1uF  [C0402]
C63  4.7nF  [C0402]
C67  100nF  [C0402]
C68  100nF  [C0402]
C69  100nF  [C0402]
C70  100nF  [C0402]
C74  100nF  [C0402]
D4  1N4148WT  [SOD523]
D16  value 30V  [SOD323-R]  (hidden comment: RSB39VTE-17)
FB5  120R  [FB0603]
FID1  FIDUCIAL  [FIDUCIAL-1X2]  (value not drawn)
FID2  FIDUCIAL  [FIDUCIAL-1X2]  (value not drawn)
FID3  FIDUCIAL  [FIDUCIAL-1X2]  (value not drawn)
JP1  SJ  [SJ]  (no BOM)
JP3  0R0  [R0805]
JP4  0R0  [R0805]
LED4  YEL  [LED2012120]
LED10  YEL  [LED2012120]
LOGO1  OSHW_LOGO_8MILX0150-NT  [OSHW_8X150_NOTEXT]  (value not drawn)  (no BOM)
R1  22R  [R0402]
R2  22R  [R0402]
R47  10K  [R0402]
R62  10K  [R0402]
R72  1M  [R0402]
RN5  1K  [CAY16]  (parts A,B,C,D of 4)
RV1  value 5V  [R0603]  (hidden comment: CG0603MLC-05E)
RV2  value 5V  [R0603]  (hidden comment: CG0603MLC-05E)
RV26  value 5V  [R0603]  (hidden comment: CG0603MLC-05E)
TP11  TestPoint  [TP1-27]  (value not drawn)  (no BOM)
TP24  TestPoint  [TP1-27]  (value not drawn)  (no BOM)
TP25  TestPoint  [TP1-27]  (value not drawn)  (no BOM)
TP26  TestPoint  [TP1-27]  (value not drawn)  (no BOM)
TP28  TestPoint  [TP1-27]  (value not drawn)  (no BOM)
TP29  TestPoint  [TP1-27]  (value not drawn)  (no BOM)
TP30  TestPoint  [TP1-27]  (value not drawn)  (no BOM)
TP31  TestPoint  [TP1-27]  (value not drawn)  (no BOM)
TP35  TestPoint  [TP1-27]  (value not drawn)  (no BOM)
TP42  TestPoint  [TP1-27]  (value not drawn)  (no BOM)
TP43  TestPoint  [TP1-27]  (value not drawn)  (no BOM)
TP44  TestPoint  [TP1-27]  (value not drawn)  (no BOM)
TP45  TestPoint  [TP1-27]  (value not drawn)  (no BOM)
TP46  TestPoint  [TP1-27]  (value not drawn)  (no BOM)
TP47  TestPoint  [TP1-27]  (value not drawn)  (no BOM)
U1  Atmega32u2  [QFN32_DualSolderMask]
U10  ADUM7441  [QSOP16]
X2  USB-B  [PN61729]  (value not drawn)
X17  PINHD-2X3  [2X03]
Y2  value 16MHz  [CRYS320250]  (hidden comment: 7M-16.000MEEQ-T)

### Ports
DTR, RST-IO, RX0, RX0-I, TX0, TX0-I, XTRA_0

### Nets
FGND: D16.C
GND: C68.1 C69.2 JP4.2 U10.9(GND2B) U10.15(GND2A)
GND1: C2.1 C11.2 C12.2 C13.2 C14.2 C15.2 C16.2 C63.2 C67.1 C70.2 C74.2 JP4.1 R72.1 RV26.1 TP47.TP U1.3(GND) U1.28(UGND) U1.33(PAD) U10.2(GND1A) U10.8(GND1B) X2.4 X17.6 Y2.2(GND) Y2.4(GND)
USBVCC: C2.2 C11.1 C14.1 C15.1 C67.2 C70.1 D4.C FB5.1 JP3.1 R47.2 R62.2 RN5.1 RN5.2 RN5.3 RN5.4 RV26.2 TP46.TP U1.4(VCC) U1.31(UVCC) U10.1(VDD1A) U10.7(VDD1B) X2.1 X17.2
VCC: C68.2 C69.1 JP3.2 U10.10(VDD2B) U10.16(VDD2A)
D+: R2.1 RV2.2 TP35.TP X2.3
D-: R1.1 RV1.2 TP28.TP X2.2
DTR: JP1.1 JP1.2 RN5.5 TP24.TP U1.13((CTS/HWB/AIN6/TO/INT7)PD7) U10.3(VIA) ; port DTR
MISO2: TP43.TP U1.17((PD0/MISO/PCINT3)PB3) X17.1
MOSI2: TP42.TP U1.16((PDI/MOSI/PCINT2)PB2) X17.4
RD+: R2.2 U1.29(D+)
RD-: R1.2 U1.30(D-)
RESET2: D4.A R47.1 TP44.TP U1.24(RESET(PC1/DW)) X17.5
RST-IO: TP29.TP U10.14(VOA) ; port RST-IO
RX0: TP30.TP U10.12(VOC) ; port RX0
RX0-I: TP25.TP U1.9((TXD1/INT3)PD3) U10.5(VIC) ; port RX0-I
RXL: LED10.C U1.10((INT5/AIN3)PD4)
SCK2: TP45.TP U1.15((SCLK/PCINT1)PB1) X17.3
TX0: TP31.TP U10.11(VID) ; port TX0
TX0-I: TP26.TP U1.8((RXD1/AIN1/INT2)PD2) U10.6(VOD) ; port TX0-I
TXL: LED4.C U1.11((XCK/AIN4/PCINT12)PD5)
USHIELD: C63.1 D16.A R72.2 RV1.1 RV2.1 X2.P$1 X2.P$2
XT1: C13.1 U1.1(XTAL1) Y2.1(C1)
XT2: C12.1 U1.2(XTAL2(PC0)) Y2.3(C2)
XTRA0: R62.1 U1.20((PCINT6)PB6) U10.4(VIB)
XTRA_0: TP11.TP U10.13(VOB) ; port XTRA_0
NetC16_1: C16.1 U1.27(UCAP)
NetC74_1: C74.1 FB5.2 U1.32(AVCC)
NetLED4_A: LED4.A RN5.6
NetLED10_A: LED10.A RN5.7

Not connected (* = marked no-connect by the designer): RN5 8(2)*; U1 5((AIN2/PCINT11)PC2)* 6((OC0B/INT0)PD0)* 7((AIN0/INT1)PD1)* 12((RTS/AIN5/INT6)PD6)* 14((SS/PCINT0)PB0)* 18((T1/PCINT4)PB4)* 19((PCINT5)PB5)* 21((PCINT7/OC0A/OC1C)PB7)* 22((INT4/ICP1/CLK0)PC7)* 23((OC1A/PCINT8)PC6)* 25((PCINT9/OC1B)PC5)* 26((PCINT10)PC4)*

### Notes on the sheet
- USB to Serial
- (near X17) 32u2
- Atmega 32u2 USB
- (near X17) ICSP
- (near X2) USB
- (near JP1) USB boot En
- TX
- (near RN5) RX
- (near C70) I-Coupler
- Reference Designs ARE PROVIDED "AS IS" AND "WITH ALL FAULTS". We DISCLAIMS ALL OTHER WARRANTIES,
- MERCHANTABILITY OR FITNESS FOR A PARTICULAR PURPOSE.
- EXPRESS OR IMPLIED, REGARDING PRODUCTS, INCLUDING BUT NOT LIMITED TO, ANY IMPLIED WARRANTIES OF
- (near LOGO1) Logo
- Fiducials
- must not rely on the absence or characteristics of any features
- We may make changes to specifications and product descriptions at any time, without notice. The Customer
- or instructions marked "reserved" or
- Copyright 2017 - UltiMachine
- (near LOGO1) Open Source Hardware
- incompatibilities arising from future changes to them. The product information on the
- "undefined." We reserve these for future definition and shall have no responsibility whatsoever for conflicts or
- subject to change without notice. Do not finalize a design with this information.
- Web Site or Materials is
- Title:
- Project:
- File:
- Ver:
- Drawn by:
- Sheet:
- of

### Library data of the parts
C2 = C0805C106K8PACTU: as C45 on sheet Power-SMPS; VALUE: 10uF; MANUFACTURER #: C0805C106K8PACTU; DISTRIBUTOR #: 399-4925-2-ND; DISTRIBUTOR: Digi-Key; PART: 10uF
C11 C14 C15 C67-C70 C74 = GRM155R71C104KA88D: as C17 on sheet Power-SMPS; VALUE: 100nF; MANUFACTURER #: GRM155R71C104KA88D; DISTRIBUTOR #: 490-3261-2-ND; DISTRIBUTOR: Digi-Key; PART: 100nF
C12 C13 = 04025A220JAT2A: as C1 on sheet MCU; VALUE: 22pF; MANUFACTURER #: 04025A220JAT2A; DISTRIBUTOR #: 478-1074-2-ND; DISTRIBUTOR: Digi-Key; PART: 22pF 50V; Tolerance: 5%
C16 = GRM155R60J105KE19D: CAP CER 0402 1uF 6.3V 10% X5R; Manufacturer: Murata; Part Description: 1µF ±10% 6.3V Ceramic Capacitor X5R 0402 (1005 Metric); EE_SPEC: 1uF 6.3V X5R 0402; Tolerance: +/- 10%; VALUE: 1uF; MANUFACTURER #: GRM155R60J105KE19D; DISTRIBUTOR #: 490-1320-2-ND; DISTRIBUTOR: Digi-Key; PART: 1uF
C63 = CC0402KRX7R8BB472: as C49 on sheet Power-SMPS; VALUE: 4.7nF; MANUFACTURER #: CC0402KRX7R8BB472; DISTRIBUTOR #: 311-1039-2-ND; DISTRIBUTOR: Digi-Key; PART: 4.7nF
D4 = 1N4148WT: as D3 on sheet MCU; Value: 1N4148WT; DISTRIBUTOR #: 1N4148WTTR-ND; DISTRIBUTOR: Digi-Key; MANUFACTURER #: 1N4148WT; PART: 1N4148WT
D16 = RSB39VTE-17: DIODE TVS; Manufacturer: Rohm; Part Description: TVS DIODE 30VWM SOD323; EE_SPEC: 30Vrs 35.1Vbd 30pF; Tolerance: NA; MANUFACTURER #: RSB39VTE-17; DISTRIBUTOR #: RSB39VTE-17TR-ND; DISTRIBUTOR: Digi-Key; PART: 30V
FB5 = FERRITE 120R 3A 0603: as FB4 on sheet Power-SMPS; DISTRIBUTOR #: 1276-6351-2-ND; DISTRIBUTOR: DigiKey; PART: FERRITE 120R 3A 0603; PART DESCRIPTION: FERRITE BEAD 120 OHM 0603 1LN
JP1 = SJ: SMD solder jumper
JP3 JP4 = 0R0 1% 0805: RES 0.0 OHM 1/8W JUMP 0805 SMD; MANUFACTURER: STACKPOLE; MANUFACTURER #: RMCF0805ZT0R00; PART DESCRIPTION: 0 Ohms Jumper 0.125W, 1/8W Chip Resistor 0805 (2012 Metric) Automotive AEC-Q200 Thick Film; TOLERANCE: 1%; EE_SPEC: 0.125W; PART: 0R0; DISTRIBUTOR: Digi-Key; DISTRIBUTOR #: RMCF0805ZT0R00CT-ND; VALUE: 0R0
LED4 LED10 = 5988140107F: as LED1 on sheet MCU; VALUE: YEL; MANUFACTURER #: 5988140107F; DISTRIBUTOR #: 350-2041-2-ND; DISTRIBUTOR: Digi-Key; PART: YEL
R1 R2 = RC0402FR-0722RL: as R20 on sheet MCU; VALUE: 22R; DISTRIBUTOR #: 311-22.0LRTR-ND; DISTRIBUTOR: Digi-Key; MANUFACTURER #: RC0402FR-0722RL; PART: 22R
R47 R62 = RC0402FR-0710KP: as R11 on sheet Power-SMPS; VALUE: 10K; MANUFACTURER #: RC0402FR-0710KP; DISTRIBUTOR #: YAG1249TR-ND; DISTRIBUTOR: Digi-Key; TOLERANCE: 1%
R72 = ERJ2GEJ105X: RES 0402 1M 100mW 5%; Manufacturer: Panasonic; Part Description: 1M Ohm ±5% 0.1W, 1/10W Chip Resistor 0402 (1005 Metric) Automotive AEC-Q200 Thick Film; EE_SPEC: 1M 1% 0402; Tolerance: +/- 1%; VALUE: 1M; MANUFACTURER #: ERJ2GEJ105X; DISTRIBUTOR #: P1.0MJTR-ND; DISTRIBUTOR: Digi-Key; PART: 1M
RN5 = CAY16-102J4LF: RES ARRAY 4 RES 1K 1206 62.5mW 5%; Manufacturer: Bourns; Part Description: 1k Ohm ±5% 62.5mW Power Per Element Isolated Resistor Network/Array ±200ppm/°C 1206 (3216 Metric), Convex, Long Side Terminals; EE_SPEC: 1k 5% Array_x_4; Tolerance: +/- 5%; VALUE: 1K; MANUFACTURER #: CAY16-102J4LF; DISTRIBUTOR #: CAY16-102J4LFTR-ND; DISTRIBUTOR: Digi-Key; PART: 1K
RV1 RV2 RV26 = CG0603MLC-05E: VAR 0603 5V; Manufacturer: YAGEO; EE_SPEC: 5VDC; Tolerance: NA; MANUFACTURER #: CG0603MLC-05E; DISTRIBUTOR #: CG0603MLC-05ETR-ND; DISTRIBUTOR: Digi-Key; PART: 5VDC; Part Description: VARISTOR 0603
TP11 TP24-TP26 TP28-TP31 TP35 TP42-TP47 = TestPoint: Test Point
U1 = ATMEGA32U2-DualSolderMask: Manufacturer: Microchip; MANUFACTURER #: ATMEGA32U2-MUR; Part Description: AVR AVR® ATmega Microcontroller IC 8-Bit 16MHz 32KB (16K x 16) FLASH 32-VQFN (5x5); EE_SPEC: 5V 32KB 1KB; Tolerance: NA; DISTRIBUTOR #: ATMEGA32U2-MURTR-ND; DISTRIBUTOR: Digi-Key; PART: ATMEGA32U2; VALUE: ATMEGA32U2
U10 = ADUM7441: 4ch iCoupler; Manufacturer: Analog Devices; MANUFACTURER #: ADUM7441ARQZ-RL7; PART: ADUM7441ARQZ; Part Description: General Purpose Digital Isolator 1000Vrms 4 Channel 1Mbps 15kV/µs CMTI 16-SSOP (0.154", 3.90mm Width); EE_SPEC: 5V 1000Viso; Tolerance: NA; VALUE: ADUM7441ARQZ; DISTRIBUTOR #: ADUM7441ARQZ-RL7TR-ND; DISTRIBUTOR: Digi-Key
X2 = USB-B: USB connector B PTH; Manufacturer: FCI; MANUFACTURER #: 61729-0010BLF; Part Description: USB - B USB 2.0 Receptacle Connector 4 Position Through Hole, Right Angle; EE_SPEC: USB-B T-Hole R/A; Tolerance: NA; DISTRIBUTOR #: 609-1039-ND; DISTRIBUTOR: Digi-Key; PART: USB-B; VALUE: USB-B
X17 = PINHD-2X3: CONN HEADER VERT 6POS GOLD; Manufacturer: MultiComp; MANUFACTURER #: 2213S-06G; PART: 6PIN; Part Description: 6 Positions Header Connector 0.100" (2.54mm) Through Hole Gold; EE_SPEC: 10Pin 2Row 0.1" T-Hole; Tolerance: NA; VALUE: 6PIN; DISTRIBUTOR #: 08N6789; DISTRIBUTOR: Newark
Y2 = 7M-16.000MEEQ-T: as Y1 on sheet MCU; MANUFACTURER #: 7M-16.000MEEQ-T; DISTRIBUTOR #: 887-1319-2-ND; DISTRIBUTOR: Digi-Key; PART: 16MHz; Tolerance: 10ppm

## Sheet Connectors.SchDoc: Connectors
size Letter; SheetNumber: 5; SheetTotal: 11
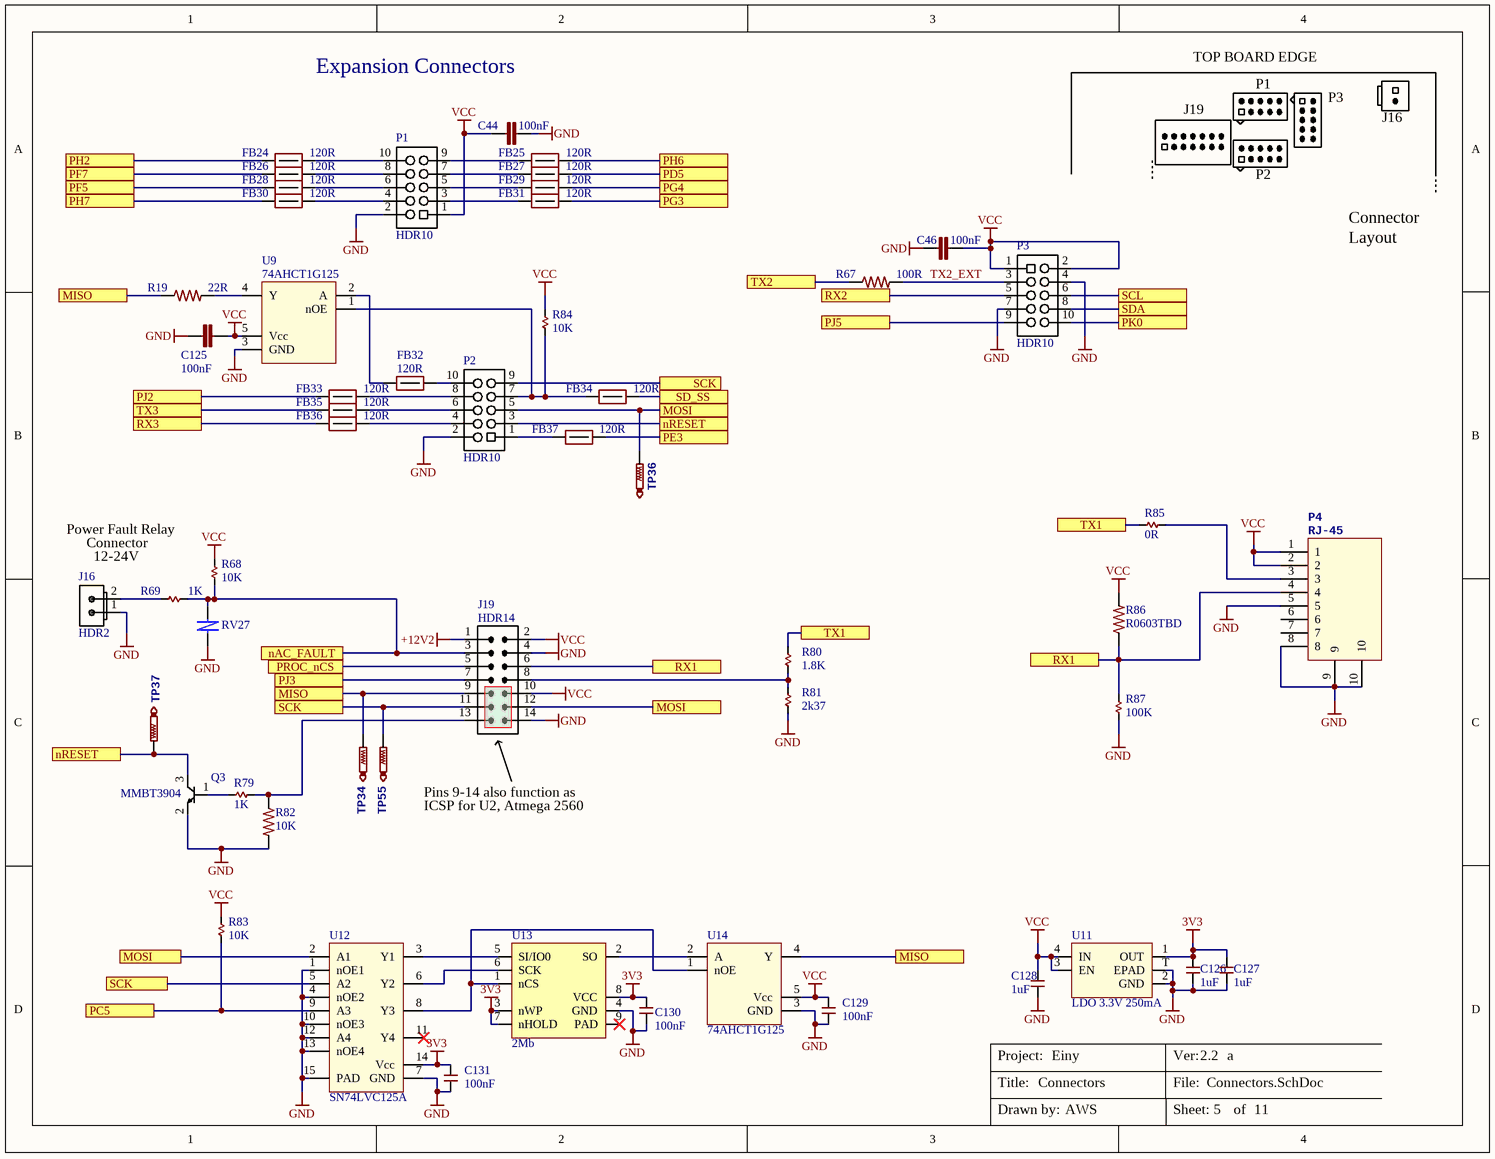
[diagram p4: Connectors.SchDoc]

### Parts
C44  100nF  [C0402]
C46  100nF  [C0402]
C125  100nF  [C0402]
C126  1uF  [C0402]
C127  1uF  [C0402]
C128  1uF  [C0402]
C129  100nF  [C0402]
C130  100nF  [C0402]
C131  100nF  [C0402]
FB24  120R  [R0402]
FB25  120R  [R0402]
FB26  120R  [R0402]
FB27  120R  [R0402]
FB28  120R  [R0402]
FB29  120R  [R0402]
FB30  120R  [R0402]
FB31  120R  [R0402]
FB32  120R  [R0402]
FB33  120R  [R0402]
FB34  120R  [R0402]
FB35  120R  [R0402]
FB36  120R  [R0402]
FB37  120R  [R0402]
J16  value HDR2  [70543-02 PIN-IN-PASTE]  (hidden comment: CONN 2PIN VERT 0.1" SHRD LOCKING)
J19  HDR14  [HDR2x7_SMT_BOT_ENTRY]
P1  HDR10  [HDR2X5 IDC]
P2  HDR10  [HDR2X5 IDC]
P3  HDR10  [HDR2X5 IDC THIEVING]
P4  RJ-45
Q3  MMBT3904  [SOT523 SMALL]
R19  22R  [R0402]
R67  100R  [R0402]
R68  10K  [R0402]
R69  1K  [R0402]
R79  1K  [R0402]
R80  1.8K  [R0402]
R81  2k37  [R0402]
R82  10K  [R0402]
R83  10K  [R0402]
R84  10K  [R0402]
R85  0R  [R0603]
R86  R0603TBD  [R0603]
R87  100K  [R0603]
RV27  VRS0402SR55R101N  [C0402]  (value not drawn)
TP34  TestPoint  [TP1-27]  (value not drawn)  (no BOM)
TP36  TestPoint  [TP1-27]  (value not drawn)  (no BOM)
TP37  TestPoint  [TP1-27]  (value not drawn)  (no BOM)
TP55  TestPoint  [TP1-27]  (value not drawn)  (no BOM)
U9  74AHCT1G125  [SOTFL50P160X60-5L]
U11  LDO 3.3V 250mA  [XDFN4 1X1]
U12  SN74LVC125A  [PVQFN14_3.5X3.5]
U13  2Mb  [USON8 2X3]
U14  74AHCT1G125  [SOTFL50P160X60-5L]

### Ports
MISO, MOSI, nAC_FAULT, nRESET, PC5, PD5, PE3, PF5, PF7, PG3, PG4, PH2, PH6, PH7, PJ2, PJ3, PJ5, PK0, PROC_nCS, RX1, RX2, RX3, SCK, SCL, SD_SS, SDA, TX1, TX2, TX3

### Nets
3V3: C126.2 C127.2 C130.2 C131.1 U11.1(OUT) U12.14(Vcc) U13.3(nWP) U13.7(nHOLD) U13.8(VCC)
+12V2: J19.1(S)
GND: C44.2 C46.1 C125.1 C126.1 C127.1 C128.1 C129.1 C130.1 C131.2 J16.1(S) J19.4(S) J19.14(S) P1.2 P2.2 P3.4 P3.7 P4.5 P4.8 P4.9 P4.10 Q3.2(E) R81.2 R82.2 R87.1 RV27.1 U9.3(GND) U11.2(GND) U11.T(EPAD) U12.1(nOE1) U12.4(nOE2) U12.7(GND) U12.10(nOE3) U12.12(A4) U12.13(nOE4) U12.15(PAD) U13.4(GND) U14.3(GND)
VCC: C44.1 C46.2 C125.2 C128.2 C129.2 J19.2(S) J19.10(S) P1.1 P3.1 P3.2 P4.1 P4.2 R68.2 R83.1 R84.2 R86.2 U9.5(Vcc) U11.3(EN) U11.4(IN) U14.5(Vcc)
MISO: J19.9(S) R19.1 TP34.TP U14.4(Y) ; port MISO
MOSI: J19.12(S) P2.5 TP36.TP U12.2(A1) ; port MOSI
nAC_FAULT: J19.3(S) R68.1 R69.2 RV27.2 ; port nAC_FAULT
nRESET: P2.3 Q3.3(C) TP37.TP ; port nRESET
PC5: R83.2 U12.9(A3) ; port PC5
PD5: FB27.2 ; port PD5
PE3: FB37.2 ; port PE3
PF5: FB28.1 ; port PF5
PF7: FB26.1 ; port PF7
PG3: FB31.2 ; port PG3
PG4: FB29.2 ; port PG4
PH2: FB24.1 ; port PH2
PH6: FB25.2 ; port PH6
PH7: FB30.1 ; port PH7
PJ2: FB33.1 ; port PJ2
PJ3: J19.7(S) ; port PJ3
PJ5: P3.9 ; port PJ5
PK0: P3.10 ; port PK0
PROC_nCS: J19.5(S) ; port PROC_nCS
RX1: J19.6(S) P4.4 R86.1 R87.2 ; port RX1
RX2: P3.5 ; port RX2
RX3: FB36.1 ; port RX3
SCK: J19.11(S) P2.9 TP55.TP U12.5(A2) ; port SCK
SCL: P3.6 ; port SCL
SD_SS: FB34.2 ; port SD_SS
SDA: P3.8 ; port SDA
TX1: R80.1 R85.1 ; port TX1
TX2: R67.1 ; port TX2
TX2_EXT: P3.3 R67.2
TX3: FB35.1 ; port TX3
NetFB24_2: FB24.2 P1.10
NetFB25_1: FB25.1 P1.9
NetFB26_2: FB26.2 P1.8
NetFB27_1: FB27.1 P1.7
NetFB28_2: FB28.2 P1.6
NetFB29_1: FB29.1 P1.5
NetFB30_2: FB30.2 P1.4
NetFB31_1: FB31.1 P1.3
NetFB32_1: FB32.1 U9.2(A)
NetFB32_2: FB32.2 P2.10
NetFB33_2: FB33.2 P2.8
NetFB34_1: FB34.1 P2.7 R84.1 U9.1(nOE)
NetFB35_2: FB35.2 P2.6
NetFB36_2: FB36.2 P2.4
NetFB37_1: FB37.1 P2.1
NetJ16_2: J16.2(S) R69.1
NetJ19_8: J19.8(S) R80.2 R81.1
NetJ19_13: J19.13(S) R79.1 R82.1
NetP4_3: P4.3 R85.2
NetQ3_1: Q3.1(B) R79.2
NetR19_2: R19.2 U9.4(Y)
NetU12_3: U12.3(Y1) U13.5(SI/IO0)
NetU12_6: U12.6(Y2) U13.6(SCK)
NetU12_8: U12.8(Y3) U13.1(nCS) U14.1(nOE)
NetU13_2: U13.2(SO) U14.2(A)

Not connected (* = marked no-connect by the designer): P4 6 7; U9 23(NC); U12 11(Y4)* 23(NC); U13 9(PAD)*; U14 23(NC)

### Notes on the sheet
- Expansion Connectors
- TOP BOARD EDGE
- P1
- P3
- J19
- J16
- P2
- Connector
- Layout
- (near R68) Power Fault Relay
- 12-24V
- ICSP for U2, Atmega 2560
- Pins 9-14 also function as
- Title:
- Project:
- File:
- Ver:
- Drawn by:
- Sheet:
- of

### Library data of the parts
C44 C46 C125 = GRM155R71C104KA88D: as C120 on sheet Power-SMPS; VALUE: 100nF; MANUFACTURER #: GRM155R71C104KA88D; DISTRIBUTOR #: 490-3261-2-ND; DISTRIBUTOR: Digi-Key; PART: 100nF
C126-C128 = 1uF 0402 6.3V X5R: CAP CER 0402 1uF 6.3V 10% X5R; MANUFACTURER: Murata; MANUFACTURER #: GRM155R60J105KE19D; PART: 1uF 6.3V X5R 0402; PART DESCRIPTION: 1µF ±10% 6.3V Ceramic Capacitor X5R 0402 (1005 Metric); DISTRIBUTOR #: 490-1320-2-ND; DISTRIBUTOR: Digikey; TOLERANCE: 10%; EE_SPEC: 6.3V; VALUE: 1uF
C129-C131 = 100nF 0402 16V X7R: CAP CER 0402 100nF 16V 10% X7R; MANUFACTURER: Murata; MANUFACTURER #: GRM155R71C104KA88D; PART: 0.1uF 16V X7R 0402; PART DESCRIPTION: 0.10µF ±10% 16V Ceramic Capacitor X7R 0402 (1005 Metric); VALUE: 100nF; DISTRIBUTOR #: 490-3261-2-ND; DISTRIBUTOR: Digikey; TOLERANCE: 10%; EE_SPEC: 16V
FB24-FB37 = FERRITE 120R 1A 0402: as RV8 on sheet MCU; DISTRIBUTOR #: 587-1921-2-ND; DISTRIBUTOR: Digikey; PART: FERRITE 120R 1A 0402; PART DESCRIPTION: FERRITE BEAD 120 OHM 0402 1LN
J16 = CONN 2PIN VERT 0.1" SHRD LOCKING PIN-IN-PASTE: as J7 on sheet Power-SMPS; DISTRIBUTOR #: WM4800-ND; DISTRIBUTOR: Digikey; EE_SPEC: -NA-
J19 = CONN 14PIN 0.1" FEMALE 2-ROW SMT BOT-ENTRY: CONN RCPT DUAL ENTRY 14POS .100"; MANUFACTURER: TE Connectivity; MANUFACTURER #: 969973-7; PART DESCRIPTION: 14 Position Receptacle, Bottom or Top Entry Connector Gold 0.100" (2.54mm) Surface Mount; TOLERANCE: -NA-; DISTRIBUTOR #: A107060CT-ND; DISTRIBUTOR: Digikey; PART: HDR14; EE_SPEC: -NA-; VALUE: HDR14
P1-P3 = Header 10PIN 2ROW T-HOLE VERT SHROUDED: CONN HEADER VERT 10POS GOLD; MANUFACTURER #: 302-S101; MANUFACTURER: On Shore; PART DESCRIPTION: 10 Positions Header Connector 0.100" (2.54mm) Through Hole Gold; TOLERANCE: -NA-; DISTRIBUTOR #: ED1543-ND; DISTRIBUTOR: Digikey; PART: HDR10; VALUE: HDR10; EE_SPEC: -NA-
P4 = RJ45 SMT: CONN MOD JACK 8P8C R/A SHIELDED; Manufacturer: Amphenol; MANUFACTURER #: RJCSE538001; Part Description: Jack Modular Connector 8p8c (RJ45, Ethernet) 90° Angle (Right) Shielded, EMI Finger; Tolerance: NA; DISTRIBUTOR #: RJCSE538001TR-ND; DISTRIBUTOR: Digikey; PART: RJ-45
Q3 = MMBT3904_SOT523: TRANS NPN 60V 0.2A SOT523; MANUFACTURER #: MMBT3904T-7-F; MANUFACTURER: Diodes Incorporated; PART: TRANS NPN 40V 0.2A SOT523; PART DESCRIPTION: Bipolar (BJT) Transistor NPN 40V 200mA 300MHz 150mW Surface Mount SOT-523; TOLERANCE: -NA-; EE_SPEC: 40V 0.2A; DISTRIBUTOR #: MMBT3904T-FDITR-ND; DISTRIBUTOR: Digikey; VALUE: NPN
R19 = RC0402FR-0722RL: as R20 on sheet MCU; VALUE: 22R; DISTRIBUTOR #: 311-22.0LRTR-ND; DISTRIBUTOR: Digi-Key; MANUFACTURER #: RC0402FR-0722RL; PART: 22R
R67 = RES 100R 0402 1%: RES SMD 100 OHM 1% 1/16W 0402; MANUFACTURER: Yageo; MANUFACTURER #: RC0402FR-07100RL; PART: 100R 1% 0402; PART DESCRIPTION: 100 Ohm ±1% 0.063W, 1/16W Chip Resistor 0402 (1005 Metric) Moisture Resistant Thick Film; VALUE: 100R; DISTRIBUTOR #: 311-100LRTR-ND; DISTRIBUTOR: Digi-Key; TOLERANCE: 1%; EE_SPEC: 100R 1% 0402
R68 R84 = 10k 1% 0402: as R55 on sheet Power-SMPS; DISTRIBUTOR #: YAG1249TR-ND; DISTRIBUTOR: Digi-key; PART: 10k 1% 0402; TOLERANCE: 1%; VALUE: 10K
R69 R79 = RC0402FR-071KL: as R35 on sheet MCU; VALUE: 1K; MANUFACTURER #: RC0402FR-071KL; DISTRIBUTOR #: 311-1.00KLRTR-ND; DISTRIBUTOR: Digi-Key; PART: 1k
R80 = RC0402FR-071K8L: RES SMD 1.8K OHM 1% 1/16W 0402; Manufacturer: Yageo; Part Description: 1.8k Ohm ±1% 0.063W, 1/16W Chip Resistor 0402 (1005 Metric) Moisture Resistant Thick Film; EE_SPEC: 1.8k 1% 0402; Tolerance: +/- 1%; VALUE: 1.8K; MANUFACTURER #: RC0402FR-071K8L; DISTRIBUTOR #: 311-1.80KLRTR-ND; DISTRIBUTOR: Digi-Key; PART: 1.8k
R81 = RC0402FR-072K37L: as R53 on sheet Power-SMPS; VALUE: 2k37; MANUFACTURER #: RC0402FR-072K37L; DISTRIBUTOR #: 311-2.37KLRTR-ND; DISTRIBUTOR: Digi-Key; PART: 2.37k
R82 = RC0402FR-0710KP: as R11 on sheet Power-SMPS; VALUE: 10K; MANUFACTURER #: RC0402FR-0710KP; DISTRIBUTOR #: YAG1249TR-ND; DISTRIBUTOR: Digi-Key; TOLERANCE: 1%
R83 = 10k 1% 0402: RES SMD 10K OHM 1% 1/16W 0402; MANUFACTURER: Yageo; MANUFACTURER #: RC0402FR-0710KP; PART DESCRIPTION: 10k Ohm ±1% 0.063W, 1/16W Chip Resistor 0402 (1005 Metric) Moisture Resistant Thick Film; DISTRIBUTOR #: YAG1249TR-ND; DISTRIBUTOR: Digikey; PART: 10k 1% 0402; TOLERANCE: 1%; EE_SPEC: 1/16W; VALUE: 10K
R85 = 0R 0603: RES SMD 0.0OHM JUMPER 1/10W 0603; MANUFACTURER: Bourns; MANUFACTURER #: CR0603-J/-000ELF; PART DESCRIPTION: 0.0 Ohm Jumper 0.1W, 1/10W Chip Resistor 0603 (1608 Metric) Moisture Resistant Thick Film; TOLERANCE: -NA-; DISTRIBUTOR #: CR0603-J/-000ELFTR-ND; DISTRIBUTOR: Digikey; PART: 0R; EE_SPEC: 0R 0603; VALUE: 0R
R86 = R0603TBD: Resistor; LastRevisionNote: ImportComponents; Published: 23-Apr-2014; Publisher: UltiMachine; LastRevisionDate: 23-Apr-2014; VALUE: R0603TBD
R87 = 100k 1% 0603: RES SMD 100K OHM 1% 1/10W 0603; MANUFACTURER: Panasonic; MANUFACTURER #: ERJ-3EKF1003V; PART DESCRIPTION: 100 kOhms ±1% 0.1W, 1/10W Chip Resistor 0603 (1608 Metric) Automotive AEC-Q200 Thick Film; DISTRIBUTOR #: P100KHTR-ND; DISTRIBUTOR: Digikey; PART: 100k 1% 0603; TOLERANCE: 1%; EE_SPEC: 1/10W; VALUE: 100K
RV27 = VRS0402SR55R101N: Multi-Layer Varistor; Manufacturer: Yageo; Part Description: VARISTOR 12V 10A 0402; Value: 12V; EE_SPEC: 5.5Vdc 12Vvar 60pF; Tolerance: NA; DISTRIBUTOR #: 311-1516-2-ND; DISTRIBUTOR: Digi-Key; MANUFACTURER #: VRS0402SR55R101N; PART: 12V
TP34 TP36 TP37 TP55 = TestPoint: Test Point
U9 U14 = SN74AHCT1G125DRLR: IC BUS BUFF TRI-ST N-INV  SOT-553; MANUFACTURER: TI; PART DESCRIPTION: Buffer, Non-Inverting 1 Element 1 Bit per Element Push-Pull Output SOT-5; TOLERANCE: -NA-; EE_SPEC: 4.5-5.5V; MANUFACTURER #: SN74AHCT1G125DRLR; DISTRIBUTOR #: 296-19379-2-ND; DISTRIBUTOR: Digikey; PART: SN74AHCT1G125DRLR; VALUE: 74AHCT1G125
U11 = LDO 3.3V 250mA: IC REG LINEAR 3.3V 250MA 4XDFN; MANUFACTURER #: NCP160AMX330TBG; MANUFACTURER: On Semi; PART DESCRIPTION: Linear Voltage Regulator IC Positive Fixed 1 Output 3.3V 250mA 4-XDFN (1x1); TOLERANCE: -NA-; DISTRIBUTOR #: NCP160AMX330TBGOSTR-ND; DISTRIBUTOR: Digikey; PART: IC REG LINEAR 3.3V 250MA 4XDFN; VALUE: LDO 3.3V 250mA; EE_SPEC: 250mA
U12 = SN74LVC125A: IC BUS BUFF TRI-ST QD 14VQFN; MANUFACTURER #: SN74LVC125ARGYR; MANUFACTURER: TI; PART DESCRIPTION: Buffer, Non-Inverting 4 Element 1 Bit per Element Push-Pull Output 14-VQFN (3.5x3.5); TOLERANCE: -NA-; EE_SPEC: 1.65-3.6Vcc, 5V tolerant inputs; DISTRIBUTOR #: 296-13961-2-ND; DISTRIBUTOR: Digikey; PART: IC BUS BUFF TRI-ST QD 14VQFN; VALUE: SN74LVC125A
U13 = W25X20CL: IC FLASH 2MBIT 104MHZ 8USON; MANUFACTURER #: W25X20CLUXIG TR; MANUFACTURER: Winbond; PART DESCRIPTION: FLASH Memory IC 2Mb (256K x 8) SPI 104MHz 8-USON (2x3); TOLERANCE: -NA-; EE_SPEC: 3.3V; DISTRIBUTOR #: W25X20CLUXIGTR-ND; DISTRIBUTOR: Digikey; PART: IC FLASH 2MBIT 104MHZ 8USON; VALUE: 2Mb

## Sheet Endstops.SchDoc: Endstops
size Letter; SheetNumber: 6; SheetTotal: 11
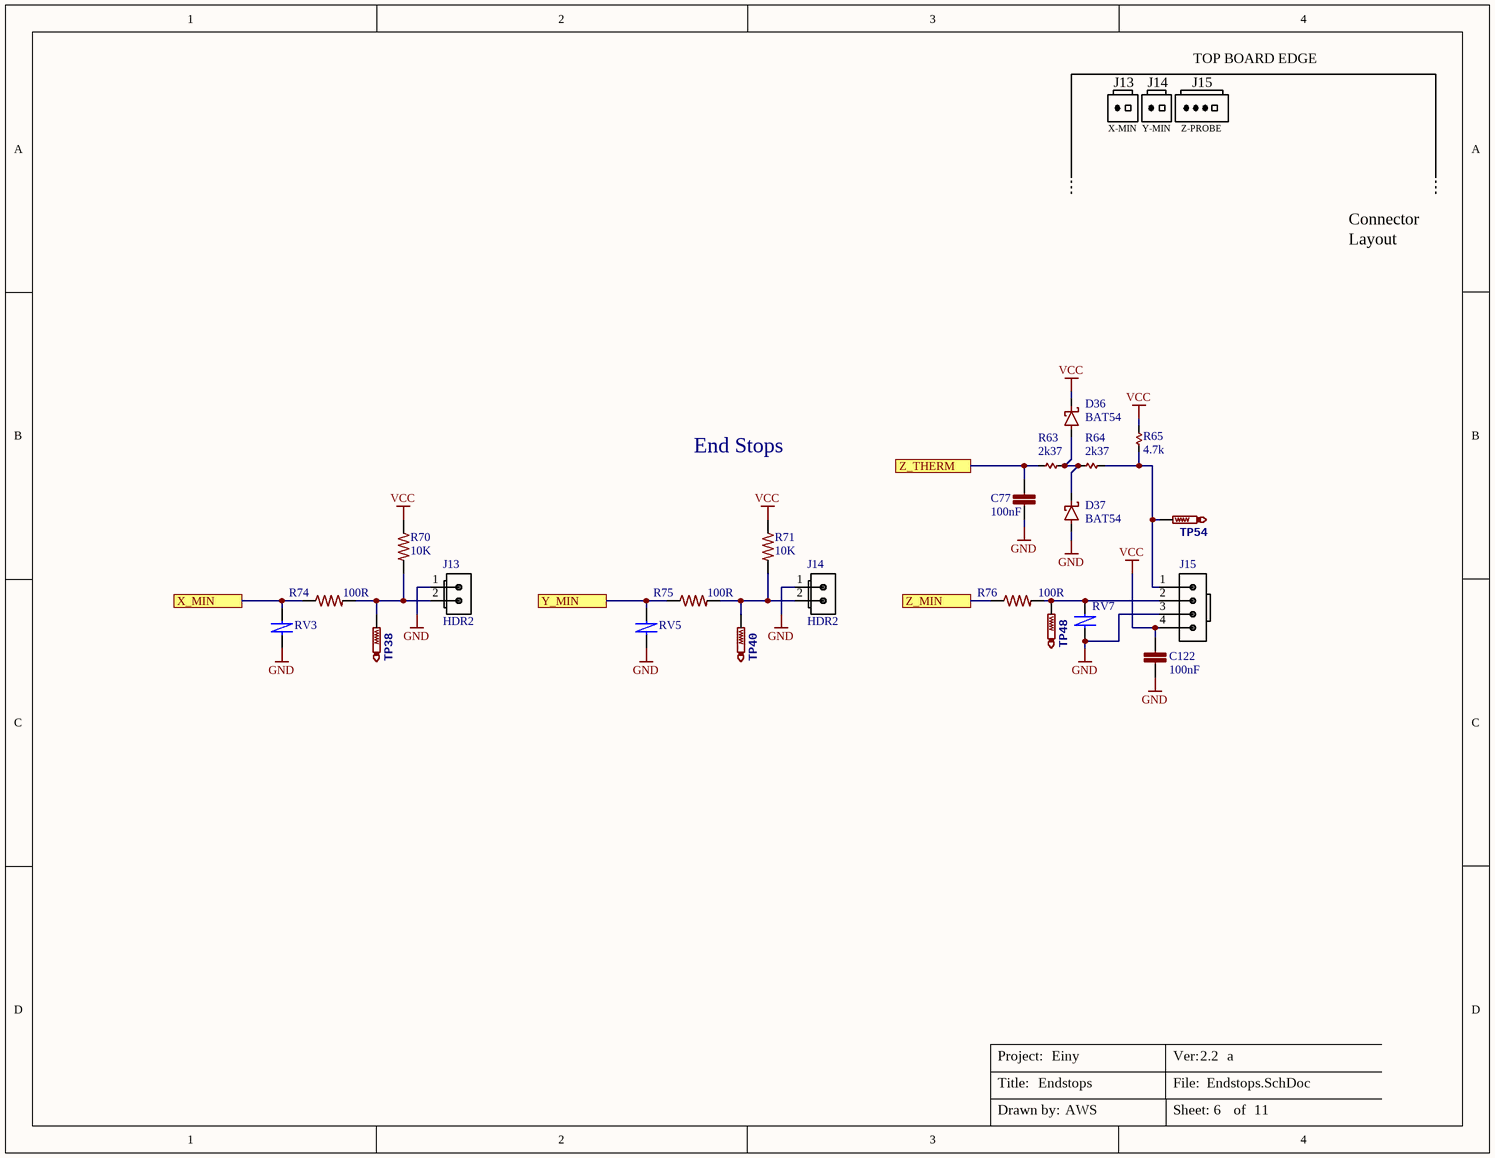
[diagram p5: Endstops.SchDoc]

### Parts
C77  100nF  [C0402]
C122  100nF  [C0402]
D36  BAT54  [SOD523_IPC]
D37  BAT54  [SOD523_IPC]
J13  value HDR2  [70543-02 PIN-IN-PASTE]  (hidden comment: CONN 2PIN VERT 0.1" SHRD LOCKING)
J14  value HDR2  [70543-02 PIN-IN-PASTE]  (hidden comment: CONN 2PIN VERT 0.1" SHRD LOCKING)
J15  Molex 0705430003  [4POL254 PIN-IN-PASTE]  (value not drawn)
R63  2k37  [R0402]
R64  2k37  [R0402]
R65  4.7k  [R0402]
R70  10K  [R0402]
R71  10K  [R0402]
R74  100R  [R0402]
R75  100R  [R0402]
R76  100R  [R0402]
RV3  VRS0402SR55R101N  [C0402]  (value not drawn)
RV5  VRS0402SR55R101N  [C0402]  (value not drawn)
RV7  VRS0402SR55R101N  [C0402]  (value not drawn)
TP38  TestPoint  [TP1-27]  (value not drawn)  (no BOM)
TP40  TestPoint  [TP1-27]  (value not drawn)  (no BOM)
TP48  TestPoint  [TP1-27]  (value not drawn)  (no BOM)
TP54  TestPoint  [TP1-27]  (value not drawn)  (no BOM)

### Ports
X_MIN, Y_MIN, Z_MIN, Z_THERM

### Nets
GND: C77.2 C122.1 D37.A J13.1(S) J14.1(S) J15.3 RV3.1 RV5.1 RV7.1
VCC: C122.2 D36.K J15.4 R65.2 R70.1 R71.1
X_MIN: R74.1 RV3.2 ; port X_MIN
Y_MIN: R75.1 RV5.2 ; port Y_MIN
Z_MIN: R76.1 ; port Z_MIN
Z_THERM: C77.1 R63.2 ; port Z_THERM
NetD36_A: D36.A D37.K R63.1 R64.2
NetJ13_2: J13.2(S) R70.2 R74.2 TP38.TP
NetJ14_2: J14.2(S) R71.2 R75.2 TP40.TP
NetJ15_1: J15.1 R64.1 R65.1 TP54.TP
NetJ15_2: J15.2 R76.2 RV7.2 TP48.TP

### Notes on the sheet
- J13
- J14
- J15
- TOP BOARD EDGE
- X-MIN
- Y-MIN
- Z-PROBE
- Connector
- Layout
- End Stops
- Title:
- Project:
- File:
- Ver:
- Drawn by:
- Sheet:
- of

### Library data of the parts
C77 = GRM155R71C104KA88D: as C17 on sheet Power-SMPS; VALUE: 100nF; MANUFACTURER #: GRM155R71C104KA88D; DISTRIBUTOR #: 490-3261-2-ND; DISTRIBUTOR: Digi-Key; PART: 100nF
C122 = GRM155R71C104KA88D: as C120 on sheet Power-SMPS; VALUE: 100nF; MANUFACTURER #: GRM155R71C104KA88D; DISTRIBUTOR #: 490-3261-2-ND; DISTRIBUTOR: Digi-Key; PART: 100nF
D36 D37 = BAT54WT-7: Diode Schottky 30V 100mA Surface Mount SOD-523; Manufacturer: Diodes Incorporated; EE_SPEC: 30V 0.1A; Tolerance: NA; Value: BAT54; MANUFACTURER #: BAT54WT-7; DISTRIBUTOR #: BAT54WT-7DI-ND; DISTRIBUTOR: Digi-Key; PART: BAT54; Part Description: Diode Schottky 30V 100mA Surface Mount SOD-523
J13 J14 = CONN 2PIN VERT 0.1" SHRD LOCKING PIN-IN-PASTE: as J7 on sheet Power-SMPS; DISTRIBUTOR #: WM4800-ND; DISTRIBUTOR: Digikey; EE_SPEC: -NA-
J15 = Molex 0705430003 PIN-IN-PASTE: Molex 4 Pin Clip Connector
R63 R64 = RC0402FR-072K37L: as R53 on sheet Power-SMPS; VALUE: 2k37; MANUFACTURER #: RC0402FR-072K37L; DISTRIBUTOR #: 311-2.37KLRTR-ND; DISTRIBUTOR: Digi-Key; PART: 2.37k
R65 = RC0402FR-074K7L: RES SMD 4.7K OHM 1% 1/16W 0402; Manufacturer: Yageo; Part Description: 4.7k Ohm ±1% 0.063W, 1/16W Chip Resistor 0402 (1005 Metric) Moisture Resistant Thick Film; EE_SPEC: 4.7k 1% 0402; Tolerance: +/- 1%; VALUE: 4.7k; MANUFACTURER #: RC0402FR-074K7L; DISTRIBUTOR #: 311-4.7KLRTR-ND; DISTRIBUTOR: Digi-Key; PART: 4.7k
R70 R71 = RC0402FR-0710KP: as R11 on sheet Power-SMPS; VALUE: 10K; MANUFACTURER #: RC0402FR-0710KP; DISTRIBUTOR #: YAG1249TR-ND; DISTRIBUTOR: Digi-Key; TOLERANCE: 1%
R74-R76 = RES 100R 0402 1%: as R67 on sheet Connectors; VALUE: 100R; DISTRIBUTOR #: 311-100LRTR-ND; DISTRIBUTOR: Digi-Key; TOLERANCE: 1%; EE_SPEC: 100R 1% 0402
RV3 RV5 RV7 = VRS0402SR55R101N: as RV27 on sheet Connectors; DISTRIBUTOR #: 311-1516-2-ND; DISTRIBUTOR: Digi-Key; MANUFACTURER #: VRS0402SR55R101N; PART: 12V
TP38 TP40 TP48 TP54 = TestPoint: Test Point